# Altium project trinity-board.PrjPcb
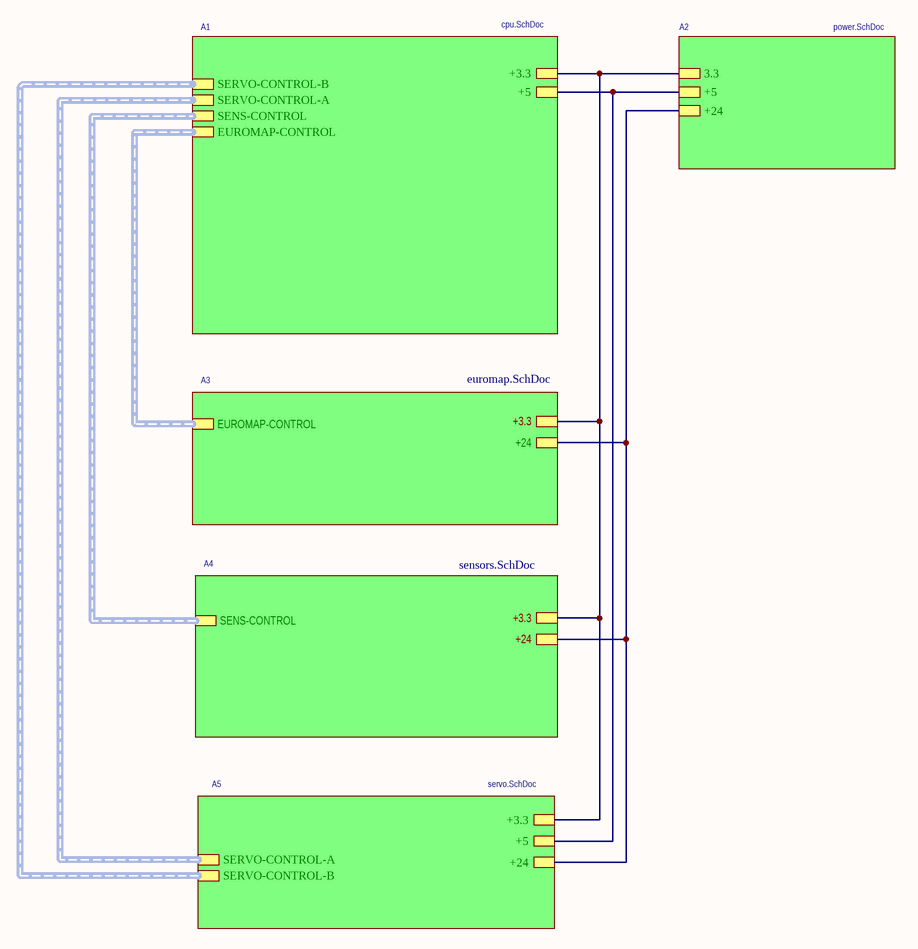
[diagram p0: main-board.SchDoc]
6 sheets, 300 parts. Net scope: hierarchical (ports join the sheet entries above them; power ports are global).
Board file: trinity-m.PcbDoc
Sheets:
  main-board.SchDoc
    A1 = cpu.SchDoc
    A2 = power.SchDoc
    A5 = servo.SchDoc
    A4 = sensors.SchDoc
    A3 = euromap.SchDoc

## Sheet main-board.SchDoc
size A3

### Sub-sheets
A1 = cpu.SchDoc: +3.3, +5, SERVO-CONTROL-B (harness SERVO-CONTROL-B), SERVO-CONTROL-A (harness SERVO-CONTROL-A), SENS-CONTROL (harness SENS-CONTROL), EUROMAP-CONTROL (harness EUROMAP-CONTROL)
A2 = power.SchDoc: +5, +24, 3.3
A3 = euromap.SchDoc: +3.3, EUROMAP-CONTROL (harness EUROMAP-CONTROL), +24
A4 = sensors.SchDoc: SENS-CONTROL (harness SENS-CONTROL), +24, +3.3
A5 = servo.SchDoc: +5, +24, +3.3, SERVO-CONTROL-A (harness SERVO-CONTROL-A), SERVO-CONTROL-B (harness SERVO-CONTROL-B)

### Nets
+3.3: sheet A1/+3.3, sheet A2/3.3, sheet A5/+3.3, sheet A4/+3.3, sheet A3/+3.3
+24: sheet A2/+24, sheet A5/+24, sheet A4/+24, sheet A3/+24
CPU18: sheet A1/+5, sheet A2/+5, sheet A5/+5

### Buses and harness runs
harness sheet A1/EUROMAP-CONTROL = sheet A3/EUROMAP-CONTROL
harness sheet A1/SENS-CONTROL = sheet A4/SENS-CONTROL
harness sheet A1/SERVO-CONTROL-A = sheet A5/SERVO-CONTROL-A
harness sheet A1/SERVO-CONTROL-B = sheet A5/SERVO-CONTROL-B

## Sheet cpu.SchDoc: CENTRAL PROCESSING UNIT
size A3; DocumentNumber: UNCNC.04.00.001
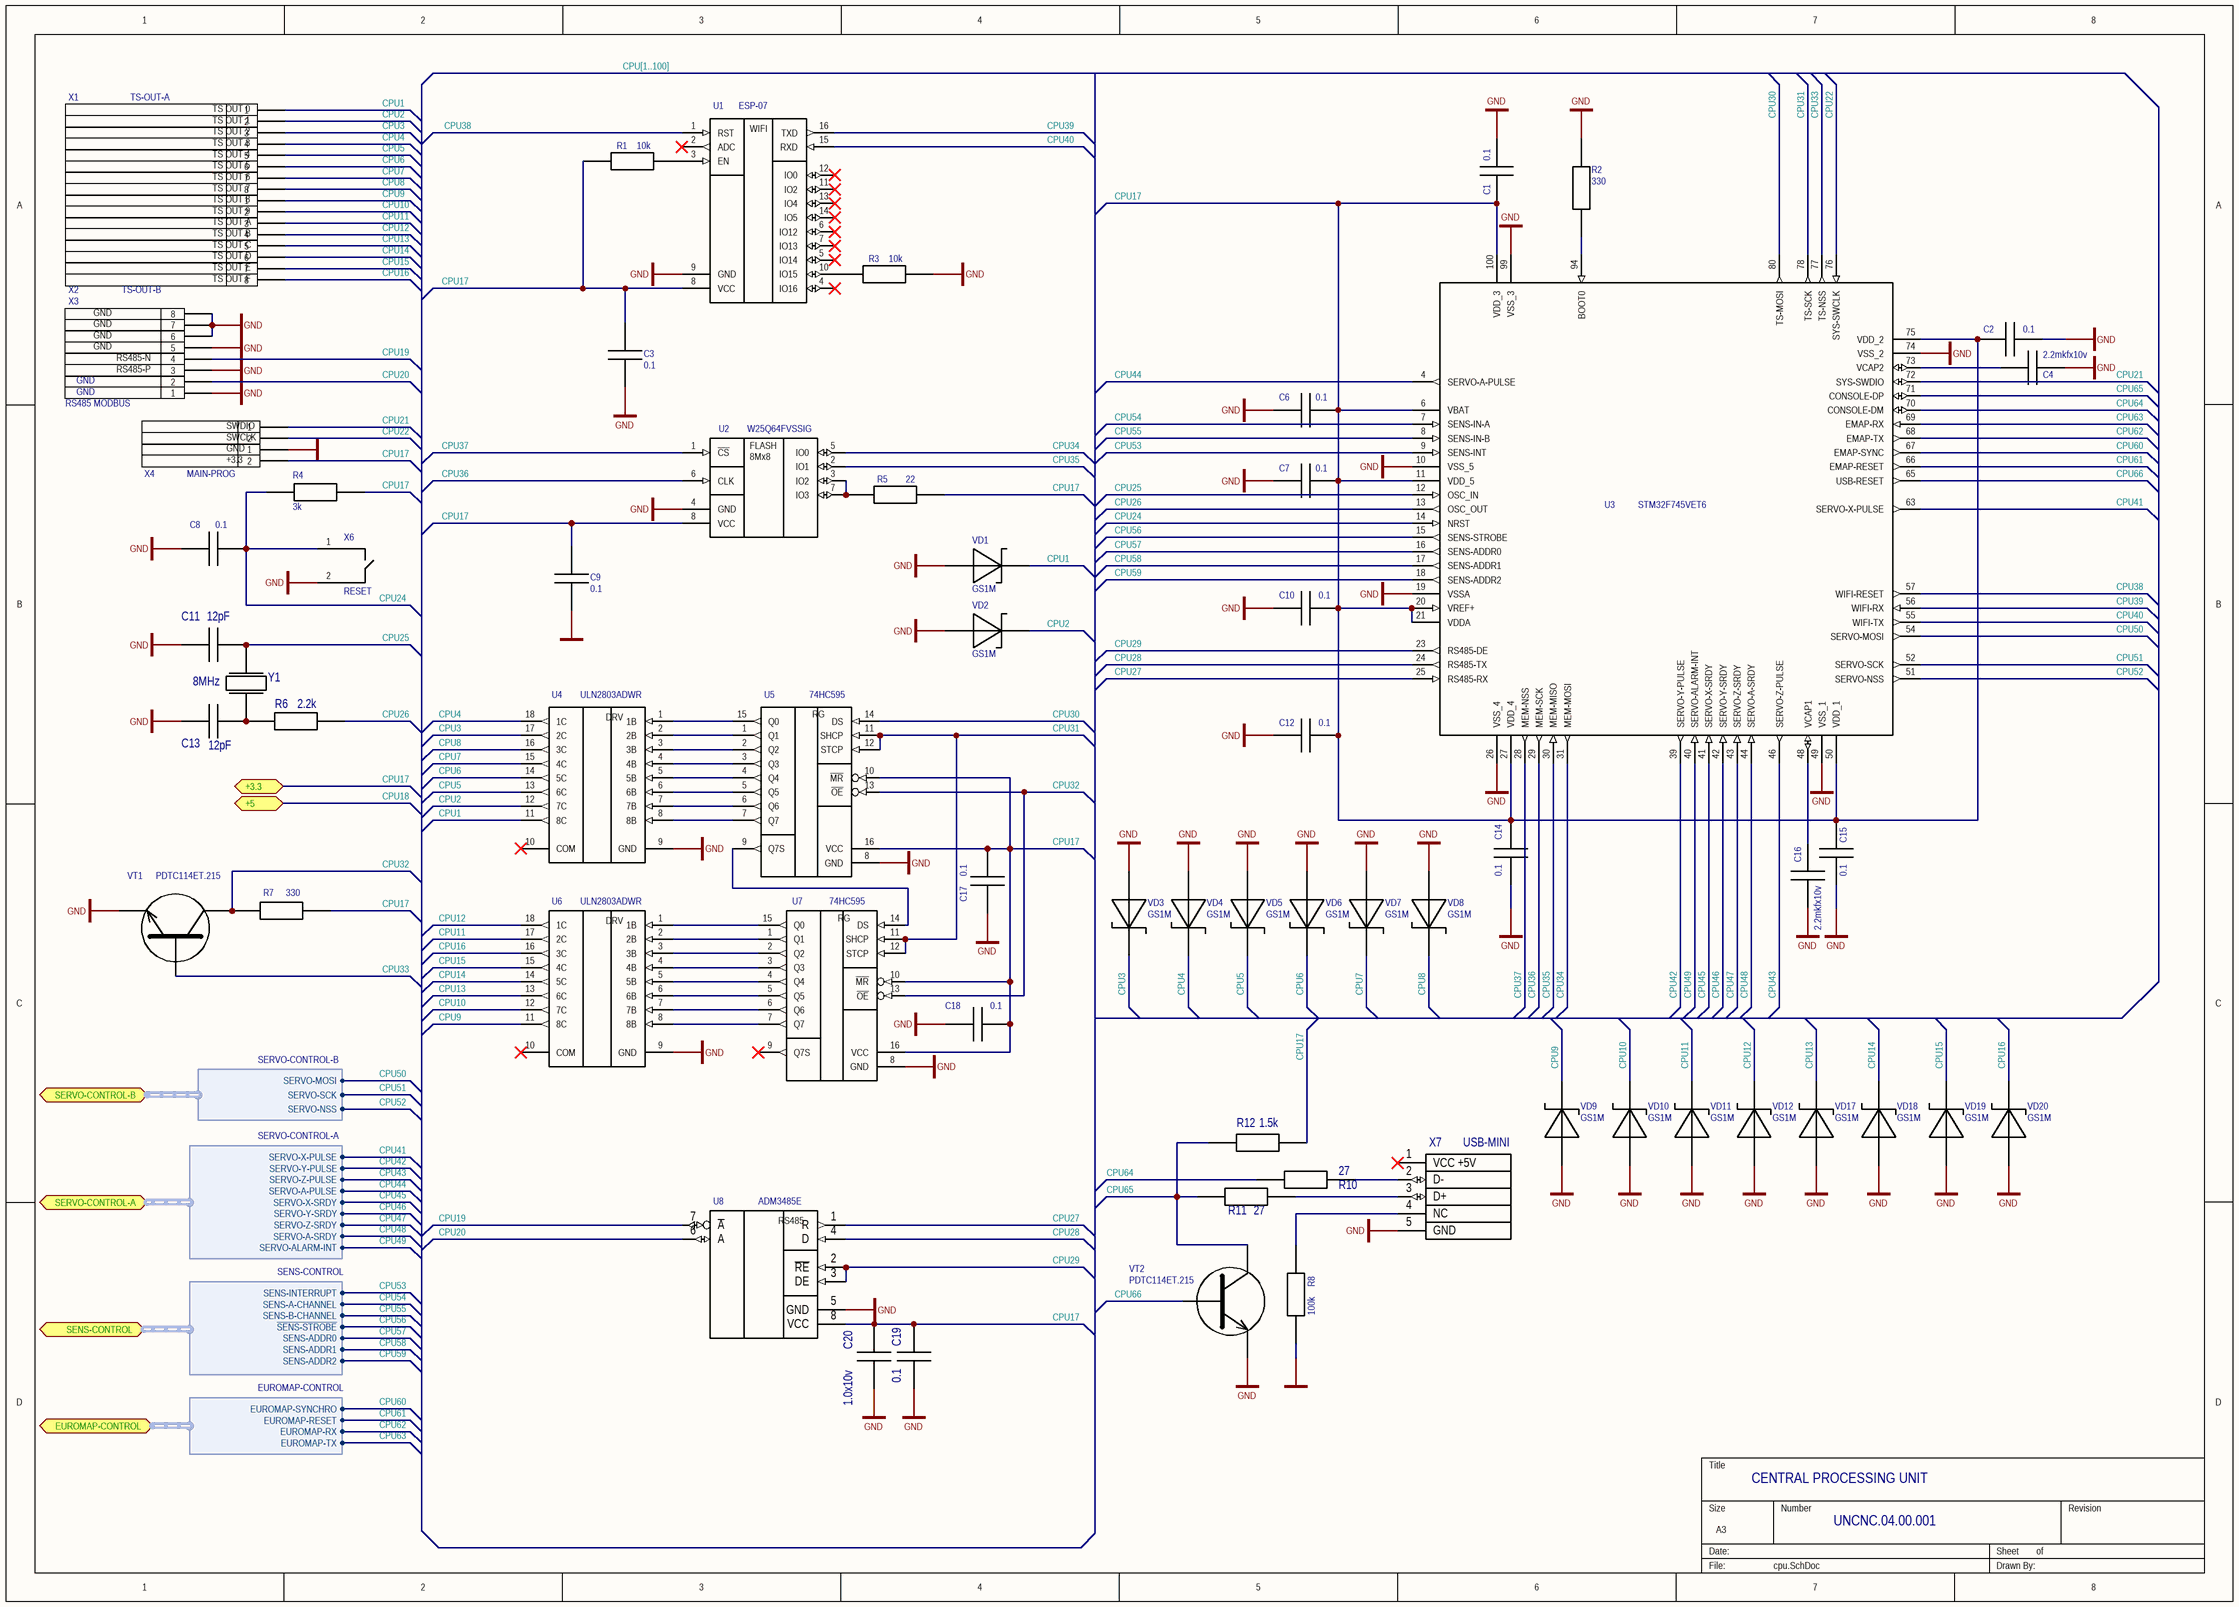
[diagram p1: cpu.SchDoc]

### Parts
C1  0.1  [CAPC1608X05N]
C2  0.1  [CAPC1608X05N]
C3  0.1  [CAPC2012X04N]
C4  2.2mkfx10v  [CAPC1608X05N]
C6  0.1  [CAPC1608X05N]
C7  0.1  [CAPC1608X05N]
C8  0.1  [CAPC1608X05N]
C9  0.1  [CAPC2012X04N]
C10  0.1  [CAPC1608X05N]
C11  12pF  [CAPC1608X05N]
C12  0.1  [CAPC1608X05N]
C13  12pF  [CAPC1608X05N]
C14  0.1  [CAPC1608X05N]
C15  0.1  [CAPC1608X05N]
C16  2.2mkfx10v  [CAPC1608X05N]
C17  0.1  [CAPC2012X04N]
C18  0.1  [CAPC2012X04N]
C19  0.1  [CAPC2012X04N]
C20  1.0x10v  [CAPC2012X04N]
R1  10k  [RESC2012X04N]
R2  330  [RESC1608X05N]
R3  10k  [RESC2012X04N]
R4  3k  [RESC1608X05N]
R5  22  [RESC2012X04N]
R6  2.2k  [RESC1608X05N]
R7  330  [RESC1608X05N]
R8  100k  [RESC2012X04N]
R10  27  [RESC2012X04N]
R11  27  [RESC2012X04N]
R12  1.5k  [RESC2012X04N]
U1  ESP-07  [ESP-07]
U2  W25Q64FVSSIG  [SOIC127P790X203-8N(WIDE)]
U3  STM32F745VET6  [TSQFP50P1600X1600X160-100N]
U4  ULN2803ADWR  [SOIC127P1030X265-18N]
U5  74HC595  [SOP127P700X210-16N]
U6  ULN2803ADWR  [SOIC127P1030X265-18N]
U7  74HC595  [SOP127P700X210-16N]
U8  ADM3485E  [SOIC127P600X175-8N]
VD1  GS1M  [DIOM4336X21N]
VD2  GS1M  [DIOM4336X21N]
VD3  GS1M  [DIOM4336X21N]
VD4  GS1M  [DIOM4336X21N]
VD5  GS1M  [DIOM4336X21N]
VD6  GS1M  [DIOM4336X21N]
VD7  GS1M  [DIOM4336X21N]
VD8  GS1M  [DIOM4336X21N]
VD9  GS1M  [DIOM4336X21N]
VD10  GS1M  [DIOM4336X21N]
VD11  GS1M  [DIOM4336X21N]
VD12  GS1M  [DIOM4336X21N]
VD17  GS1M  [DIOM4336X21N]
VD18  GS1M  [DIOM4336X21N]
VD19  GS1M  [DIOM4336X21N]
VD20  GS1M  [DIOM4336X21N]
VT1  PDTC114ET.215  [SOT95P238X102-3N]
VT2  PDTC114ET.215  [SOT95P238X102-3N]
X1  TS-OUT-A  [MINI-FIT-8-WAY-SM]
X2  TS-OUT-B  [MINI-FIT-8-WAY-SM]
X3  RS485 MODBUS  [RJ45-CAN]
X4  MAIN-PROG  [ZL201-2]
X5  Jamper ZL201  [ZL201-2]  (value not drawn)
X6  RESET  [TACT SWITCH]
X7  USB-MINI  [229-5FB-MINI-USB]
Y1  8MHz  [KX-13]

### Ports
+3.3, +5, EUROMAP-CONTROL (harness EUROMAP-CONTROL), SENS-CONTROL (harness SENS-CONTROL), SERVO-CONTROL-A (harness SERVO-CONTROL-A), SERVO-CONTROL-B (harness SERVO-CONTROL-B)

### Harnesses
SERVO-CONTROL-B: SERVO-MOSI, SERVO-SCK, SERVO-NSS
SERVO-CONTROL-A: SERVO-X-PULSE, SERVO-Y-PULSE, SERVO-Z-PULSE, SERVO-A-PULSE, SERVO-X-SRDY, SERVO-Y-SRDY, SERVO-Z-SRDY, SERVO-A-SRDY, SERVO-ALARM-INT
SENS-CONTROL: SENS-INTERRUPT, SENS-A-CHANNEL, SENS-B-CHANNEL, ~{SENS-STROBE}, SENS-ADDR0, SENS-ADDR1, SENS-ADDR2
EUROMAP-CONTROL: EUROMAP-SYNCHRO, EUROMAP-RESET, EUROMAP-RX, EUROMAP-TX

### Nets
GND: C1.2 C2.1 C3.1 C4.1 C6.2 C7.2 C8.2 C9.1 C10.2 C11.1 C12.2 C13.1 C14.1 C15.1 C16.1 C17.1 C18.1 C19.1 C20.1 R2.2 R3.2 R8.1 U1.9(GND) U2.4(GND) U3.10(VSS_5) U3.19(VSSA) U3.26(VSS_4) U3.49(VSS_1) U3.74(VSS_2) U3.99(VSS_3) U4.9(GND) U5.8(GND) U6.9(GND) U7.8(GND) U8.5(GND) VD1.2(A) VD2.2(A) VD3.2(A) VD4.2(A) VD5.2(A) VD6.2(A) VD7.2(A) VD8.2(A) VD9.2(A) VD10.2(A) VD11.2(A) VD12.2(A) VD17.2(A) VD18.2(A) VD19.2(A) VD20.2(A) VT1.2(E) VT2.2(E) X3.1 X3.3 X3.5 X3.6 X3.7 X3.8 X5.1 X6.2 X7.5(GND)
CPU1: U4.11(8C) VD1.1(C) X1.1
CPU2: U4.12(7C) VD2.1(C) X1.2
CPU3: U4.17(2C) VD3.1(C) X1.3
CPU4: U4.18(1C) VD4.1(C) X1.4
CPU5: U4.13(6C) VD5.1(C) X1.5
CPU6: U4.14(5C) VD6.1(C) X1.6
CPU7: U4.15(4C) VD7.1(C) X1.7
CPU8: U4.16(3C) VD8.1(C) X1.8
CPU9: U6.11(8C) VD9.1(C) X2.1
CPU10: U6.12(7C) VD10.1(C) X2.2
CPU11: U6.17(2C) VD11.1(C) X2.3
CPU12: U6.18(1C) VD12.1(C) X2.4
CPU13: U6.13(6C) VD17.1(C) X2.5
CPU14: U6.14(5C) VD18.1(C) X2.6
CPU15: U6.15(4C) VD19.1(C) X2.7
CPU16: U6.16(3C) VD20.1(C) X2.8
CPU17: C1.1 C2.2 C3.2 C6.1 C7.1 C9.2 C10.1 C12.1 C14.2 C15.2 C17.2 C18.2 C19.2 C20.2 R1.1 R4.1 R5.2 R7.1 R12.2 U1.8(VCC) U2.8(VCC) U3.6(VBAT) U3.11(VDD_5) U3.20(VREF+) U3.21(VDDA) U3.27(VDD_4) U3.50(VDD_1) U3.75(VDD_2) U3.100(VDD_3) U5.10(~{MR}) U5.16(VCC) U7.10(~{MR}) U7.16(VCC) U8.8(VCC) X5.2 ; port +3.3  [project net +3.3]
CPU19: U8.7(~{A}) X3.4
CPU20: U8.6(A) X3.2
CPU21: U3.72(SYS-SWDIO) X4.1
CPU22: U3.76(SYS-SWCLK) X4.2
CPU24: C8.1 R4.2 U3.14(NRST) X6.1
CPU25: C11.2 U3.12(OSC_IN) Y1.2
CPU26: R6.2 U3.13(OSC_OUT)
CPU27: U3.25(RS485-RX) U8.1(R)
CPU28: U3.24(RS485-TX) U8.4(D)
CPU29: U3.23(RS485-DE) U8.2(~{RE}) U8.3(DE)
CPU30: U3.80(TS-MOSI) U5.14(DS)
CPU31: U3.78(TS-SCK) U5.11(SHCP) U5.12(STCP) U7.11(SHCP) U7.12(STCP)
CPU32: R7.2 U5.13(~{OE}) U7.13(~{OE}) VT1.3(C)
CPU33: U3.77(TS-NSS) VT1.1(B)
CPU34: U2.5(IO0) U3.31(MEM-MOSI)
CPU35: U2.2(IO1) U3.30(MEM-MISO)
CPU36: U2.6(CLK) U3.29(MEM-SCK)
CPU37: U2.1(~{CS}) U3.28(MEM-NSS)
CPU38: U1.1(RST) U3.57(WIFI-RESET)
CPU39: U1.16(TXD) U3.56(WIFI-RX)
CPU40: U1.15(RXD) U3.55(WIFI-TX)
CPU41: U3.63(SERVO-X-PULSE) ; port SERVO-CONTROL-A.SERVO-X-PULSE
CPU42: U3.39(SERVO-Y-PULSE) ; port SERVO-CONTROL-A.SERVO-Y-PULSE
CPU43: U3.46(SERVO-Z-PULSE) ; port SERVO-CONTROL-A.SERVO-Z-PULSE
CPU44: U3.4(SERVO-A-PULSE) ; port SERVO-CONTROL-A.SERVO-A-PULSE
CPU45: U3.41(SERVO-X-SRDY) ; port SERVO-CONTROL-A.SERVO-X-SRDY
CPU46: U3.42(SERVO-Y-SRDY) ; port SERVO-CONTROL-A.SERVO-Y-SRDY
CPU47: U3.43(SERVO-Z-SRDY) ; port SERVO-CONTROL-A.SERVO-Z-SRDY
CPU48: U3.44(SERVO-A-SRDY) ; port SERVO-CONTROL-A.SERVO-A-SRDY
CPU49: U3.40(SERVO-ALARM-INT) ; port SERVO-CONTROL-A.SERVO-ALARM-INT
CPU50: U3.54(SERVO-MOSI) ; port SERVO-CONTROL-B.SERVO-MOSI
CPU51: U3.52(SERVO-SCK) ; port SERVO-CONTROL-B.SERVO-SCK
CPU52: U3.51(SERVO-NSS) ; port SERVO-CONTROL-B.SERVO-NSS
CPU53: U3.9(SENS-INT) ; port SENS-CONTROL.SENS-INTERRUPT
CPU54: U3.7(SENS-IN-A) ; port SENS-CONTROL.SENS-A-CHANNEL
CPU55: U3.8(SENS-IN-B) ; port SENS-CONTROL.SENS-B-CHANNEL
CPU56: U3.15(SENS-STROBE) ; port SENS-CONTROL.~{SENS-STROBE}
CPU57: U3.16(SENS-ADDR0) ; port SENS-CONTROL.SENS-ADDR0
CPU58: U3.17(SENS-ADDR1) ; port SENS-CONTROL.SENS-ADDR1
CPU59: U3.18(SENS-ADDR2) ; port SENS-CONTROL.SENS-ADDR2
CPU60: U3.67(EMAP-SYNC) ; port EUROMAP-CONTROL.EUROMAP-SYNCHRO
CPU61: U3.66(EMAP-RESET) ; port EUROMAP-CONTROL.EUROMAP-RESET
CPU62: U3.68(EMAP-TX) ; port EUROMAP-CONTROL.EUROMAP-RX
CPU63: U3.69(EMAP-RX) ; port EUROMAP-CONTROL.EUROMAP-TX
CPU64: R10.1 U3.70(CONSOLE-DM)
CPU65: R11.1 R12.1 U3.71(CONSOLE-DP) VT2.3(C)
CPU66: U3.65(USB-RESET) VT2.1(B)
NetC4_2: C4.2 U3.73(VCAP2)
NetC13_2: C13.2 R6.1 Y1.1
NetC16_2: C16.2 U3.48(VCAP1)
NetR1_2: R1.2 U1.3(EN)
NetR2_1: R2.1 U3.94(BOOT0)
NetR3_1: R3.1 U1.10(IO15)
NetR5_1: R5.1 U2.3(IO2) U2.7(IO3)
NetR8_2: R8.2 X7.4(NC)
NetR10_2: R10.2 X7.2(D-)
NetR11_2: R11.2 X7.3(D+)
NetU4_1: U4.1(1B) U5.15(Q0)
NetU4_2: U4.2(2B) U5.1(Q1)
NetU4_3: U4.3(3B) U5.2(Q2)
NetU4_4: U4.4(4B) U5.3(Q3)
NetU4_5: U4.5(5B) U5.4(Q4)
NetU4_6: U4.6(6B) U5.5(Q5)
NetU4_7: U4.7(7B) U5.6(Q6)
NetU4_8: U4.8(8B) U5.7(Q7)
NetU5_9: U5.9(Q7S) U7.14(DS)
NetU6_1: U6.1(1B) U7.15(Q0)
NetU6_2: U6.2(2B) U7.1(Q1)
NetU6_3: U6.3(3B) U7.2(Q2)
NetU6_4: U6.4(4B) U7.3(Q3)
NetU6_5: U6.5(5B) U7.4(Q4)
NetU6_6: U6.6(6B) U7.5(Q5)
NetU6_7: U6.7(7B) U7.6(Q6)
NetU6_8: U6.8(8B) U7.7(Q7)

Not connected (* = marked no-connect by the designer): U1 2(ADC)* 4(IO16)* 5(IO14)* 6(IO12)* 7(IO13)* 11(IO2)* 12(IO0)* 13(IO4)* 14(IO5)*; U3 1(PE2) 2(PE3) 3(PE4) 5(PE6) 22(PA0-WKUP) 32(PC4) 33(PC5) 34(PB0) 35(PB1) 36(PB2) 37(PE7) 38(PE8) 45(PE15) 47(PB11) 53(PB14) 58(PD11) 59(PD12) 60(PD13) 61(PD14) 62(PD15) 64(PC7) 79(PC11) 81(PD0) 82(PD1) 83(PD2) 84(PD3) 85(PD4) 86(PD5) 87(PD6) 88(PD7) 89(PB3) 90(PB4) 91(PB5) 92(PB6) 93(PB7) 95(PB8) 96(PB9) 97(PE0) 98(PE1); U4 10(COM)*; U6 10(COM)*; U7 9(Q7S)*; X7 1(VCC_+5V)*

### Buses and harness runs
bus CPU[1..100]

### Notes on the sheet
- (near X1) TS OUT 0
- (near X1) TS OUT 1
- (near X1) TS OUT 2
- TS OUT 3
- TS OUT 4
- TS OUT 5
- TS OUT 6
- TS OUT 7
- TS OUT 8
- TS OUT 9
- TS OUT A
- TS OUT B
- TS OUT C
- TS OUT D
- GND
- TS OUT E
- TS OUT F
- RS485-N
- RS485-P
- SWDIO
- SWCLK
- +3.3
- (in symbol 74HC595) RG
- (in symbol ESP-07 Wi-Fi module) WIFI
- (in symbol SN65176BD) RS485
- (in symbol ULN2803ADWR) DRV
- (in symbol W25Q64FVSSIG) FLASH; 8Mx8

### Library data of the parts
C1-C4 C6-C20 = C: SMD конденсатор; Ref: http://www.kosmodrom.com.ua/prodlist.php?name=cap1206
R1-R8 R10-R12 = R: SMD резистор; Ref: http://www.kosmodrom.com.ua/prodlist.php?name=res1206
U1 = ESP-07 Wi-Fi module: WIFI модуль; Ref: http://www.kosmodrom.com.ua/el.php?name=ESP8266-ESP-07
U2 = W25Q64FVSSIG: FLASH 8Mx8
U3 = STM32F745VET6: ARM7 microcontroller
U4 U6 = ULN2803ADWR: 8 Darlington transistors
U8 = SN65176BD: RS-485 line driver; Ref: http://www.kosmodrom.com.ua/prodlist.php?page=0&name=SN65176BD&okbutton=%CF%EE%E8%F1%EA+%EF%EE+%F1%EA%EB%E0%E4%F3
VD1-VD12 VD17-VD20 = SS26: диод Шоттки
VT1 VT2 = PDTC114ET.215: NPN transistor with bias circuit
X1 X2 = MINI-FIT-8-WAY-M
X3 = RJ45-CAN: CAN-Bus connector; Ref: http://www.kosmodrom.com.ua/el.php?name=TJ9S-8P8C
X4 = Jamper ZL201
X6 = TACT SWITCH
X7 = USB-MINI: Разъем USB-B розетка; Ref: http://www.kosmodrom.com.ua/el.php?name=229-5FB
Y1 = CERAMIC-RESONATOR: Кварцевый резонатор; Ref( 8MHz): http://www.kosmodrom.com.ua/el.php?name=KX-13-8.0-MHz; Ref (6MHz): http://www.kosmodrom.com.ua/el.php?name=KX-13%206.0%20MHz

## Sheet power.SchDoc
size A3
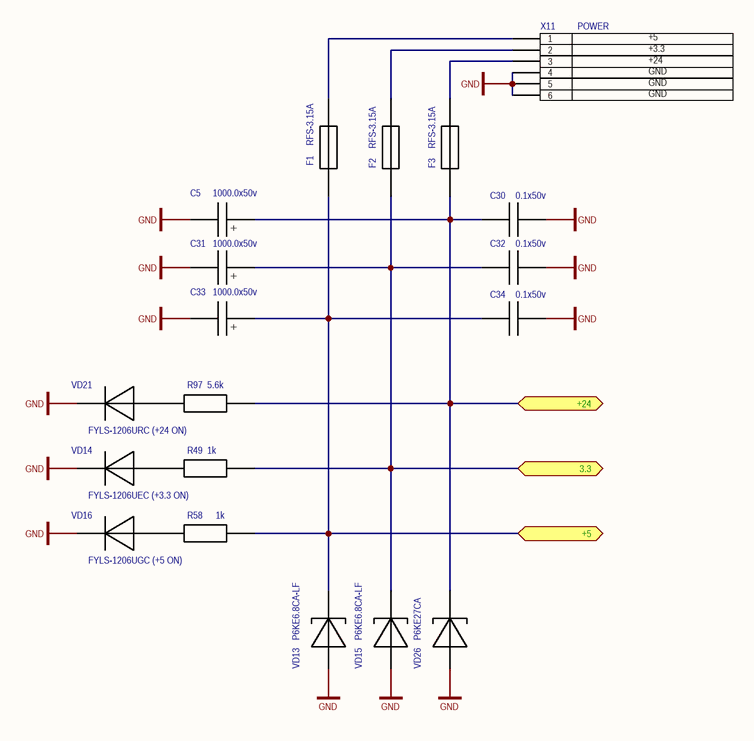
[diagram p2: power.SchDoc]

### Parts
C5  1000.0x50v  [C-LOW-ESR-16-18]
C30  0.1x50v  [CAPC3216X05N]
C31  1000.0x50v  [C-LOW-ESR-16-18]
C32  0.1x50v  [CAPC3216X05N]
C33  1000.0x50v  [C-LOW-ESR-16-18]
C34  0.1x50v  [CAPC3216X05N]
F1  RFS-3.15A  [MRT-FUSE]
F2  RFS-3.15A  [MRT-FUSE]
F3  RFS-3.15A  [MRT-FUSE]
R49  1k  [RESC2012X04N]
R58  1k  [RESC2012X04N]
R97  5.6k  [RESC2012X04N]
VD13  P6KE6.8CA-LF  [P6KE27CA]
VD14  FYLS-1206UEC (+3.3 ON)  [CAPMP3216X11N]
VD15  P6KE6.8CA-LF  [P6KE27CA]
VD16  FYLS-1206UGC (+5 ON)  [CAPMP3216X11N]
VD21  FYLS-1206URC (+24 ON)  [CAPMP3216X11N]
VD26  P6KE27CA  [P6KE27CA]
X11  POWER  [MINI-FIT-6WAY-SM]

### Ports
3.3, +5, +24

### Nets
GND: C5.2 C30.2 C31.2 C32.2 C33.2 C34.2 VD13.A VD14.1(C) VD15.A VD16.1(C) VD21.1(C) VD26.A X11.4 X11.5 X11.6
+3.3: C31.1(+) C32.1 F2.1 R49.2 VD15.K ; port 3.3
+24: C5.1(+) C30.1 F3.1 R97.2 VD26.K ; port +24
CPU18: C33.1(+) C34.1 F1.1 R58.2 VD13.K ; port +5
NetF1_2: F1.2 X11.1
NetF2_2: F2.2 X11.2
NetF3_2: F3.2 X11.3
NetR49_1: R49.1 VD14.2(A)
NetR58_1: R58.1 VD16.2(A)
NetR97_1: R97.1 VD21.2(A)

### Notes on the sheet
- +5
- +3.3
- +24
- GND

### Library data of the parts
C5 C31 C33 = C-LOW-ESR-RADIAL: Выводной электролит
C30 C32 C34 = C: SMD конденсатор; Ref: http://www.kosmodrom.com.ua/prodlist.php?name=cap1206
F1-F3 = FUSE: Вставка плавкая; Ref: http://www.kosmodrom.com.ua/el.php?name=RFT-2.5A
R49 R58 R97 = R: SMD резистор; Ref: http://www.kosmodrom.com.ua/prodlist.php?name=res1206
VD13 VD15 VD26 = P6KE27CA: Cупрессор; Ref: https://prom.ua/p207053054-p6ke27ca;all.html
VD14 VD16 VD21 = FYLS-1206: Светодиод; Ref: http://www.kosmodrom.com.ua/prodlist.php?page=0&name=FYLS-1206&okbutton=%CF%EE%E8%F1%EA+%EF%EE+%F1%EA%EB%E0%E4%F3
X11 = MINI-FIT-6-WAY-M

## Sheet servo.SchDoc: SERVOCONTROLLER module
size A3; DocumentNumber: UCNC.03.00.001
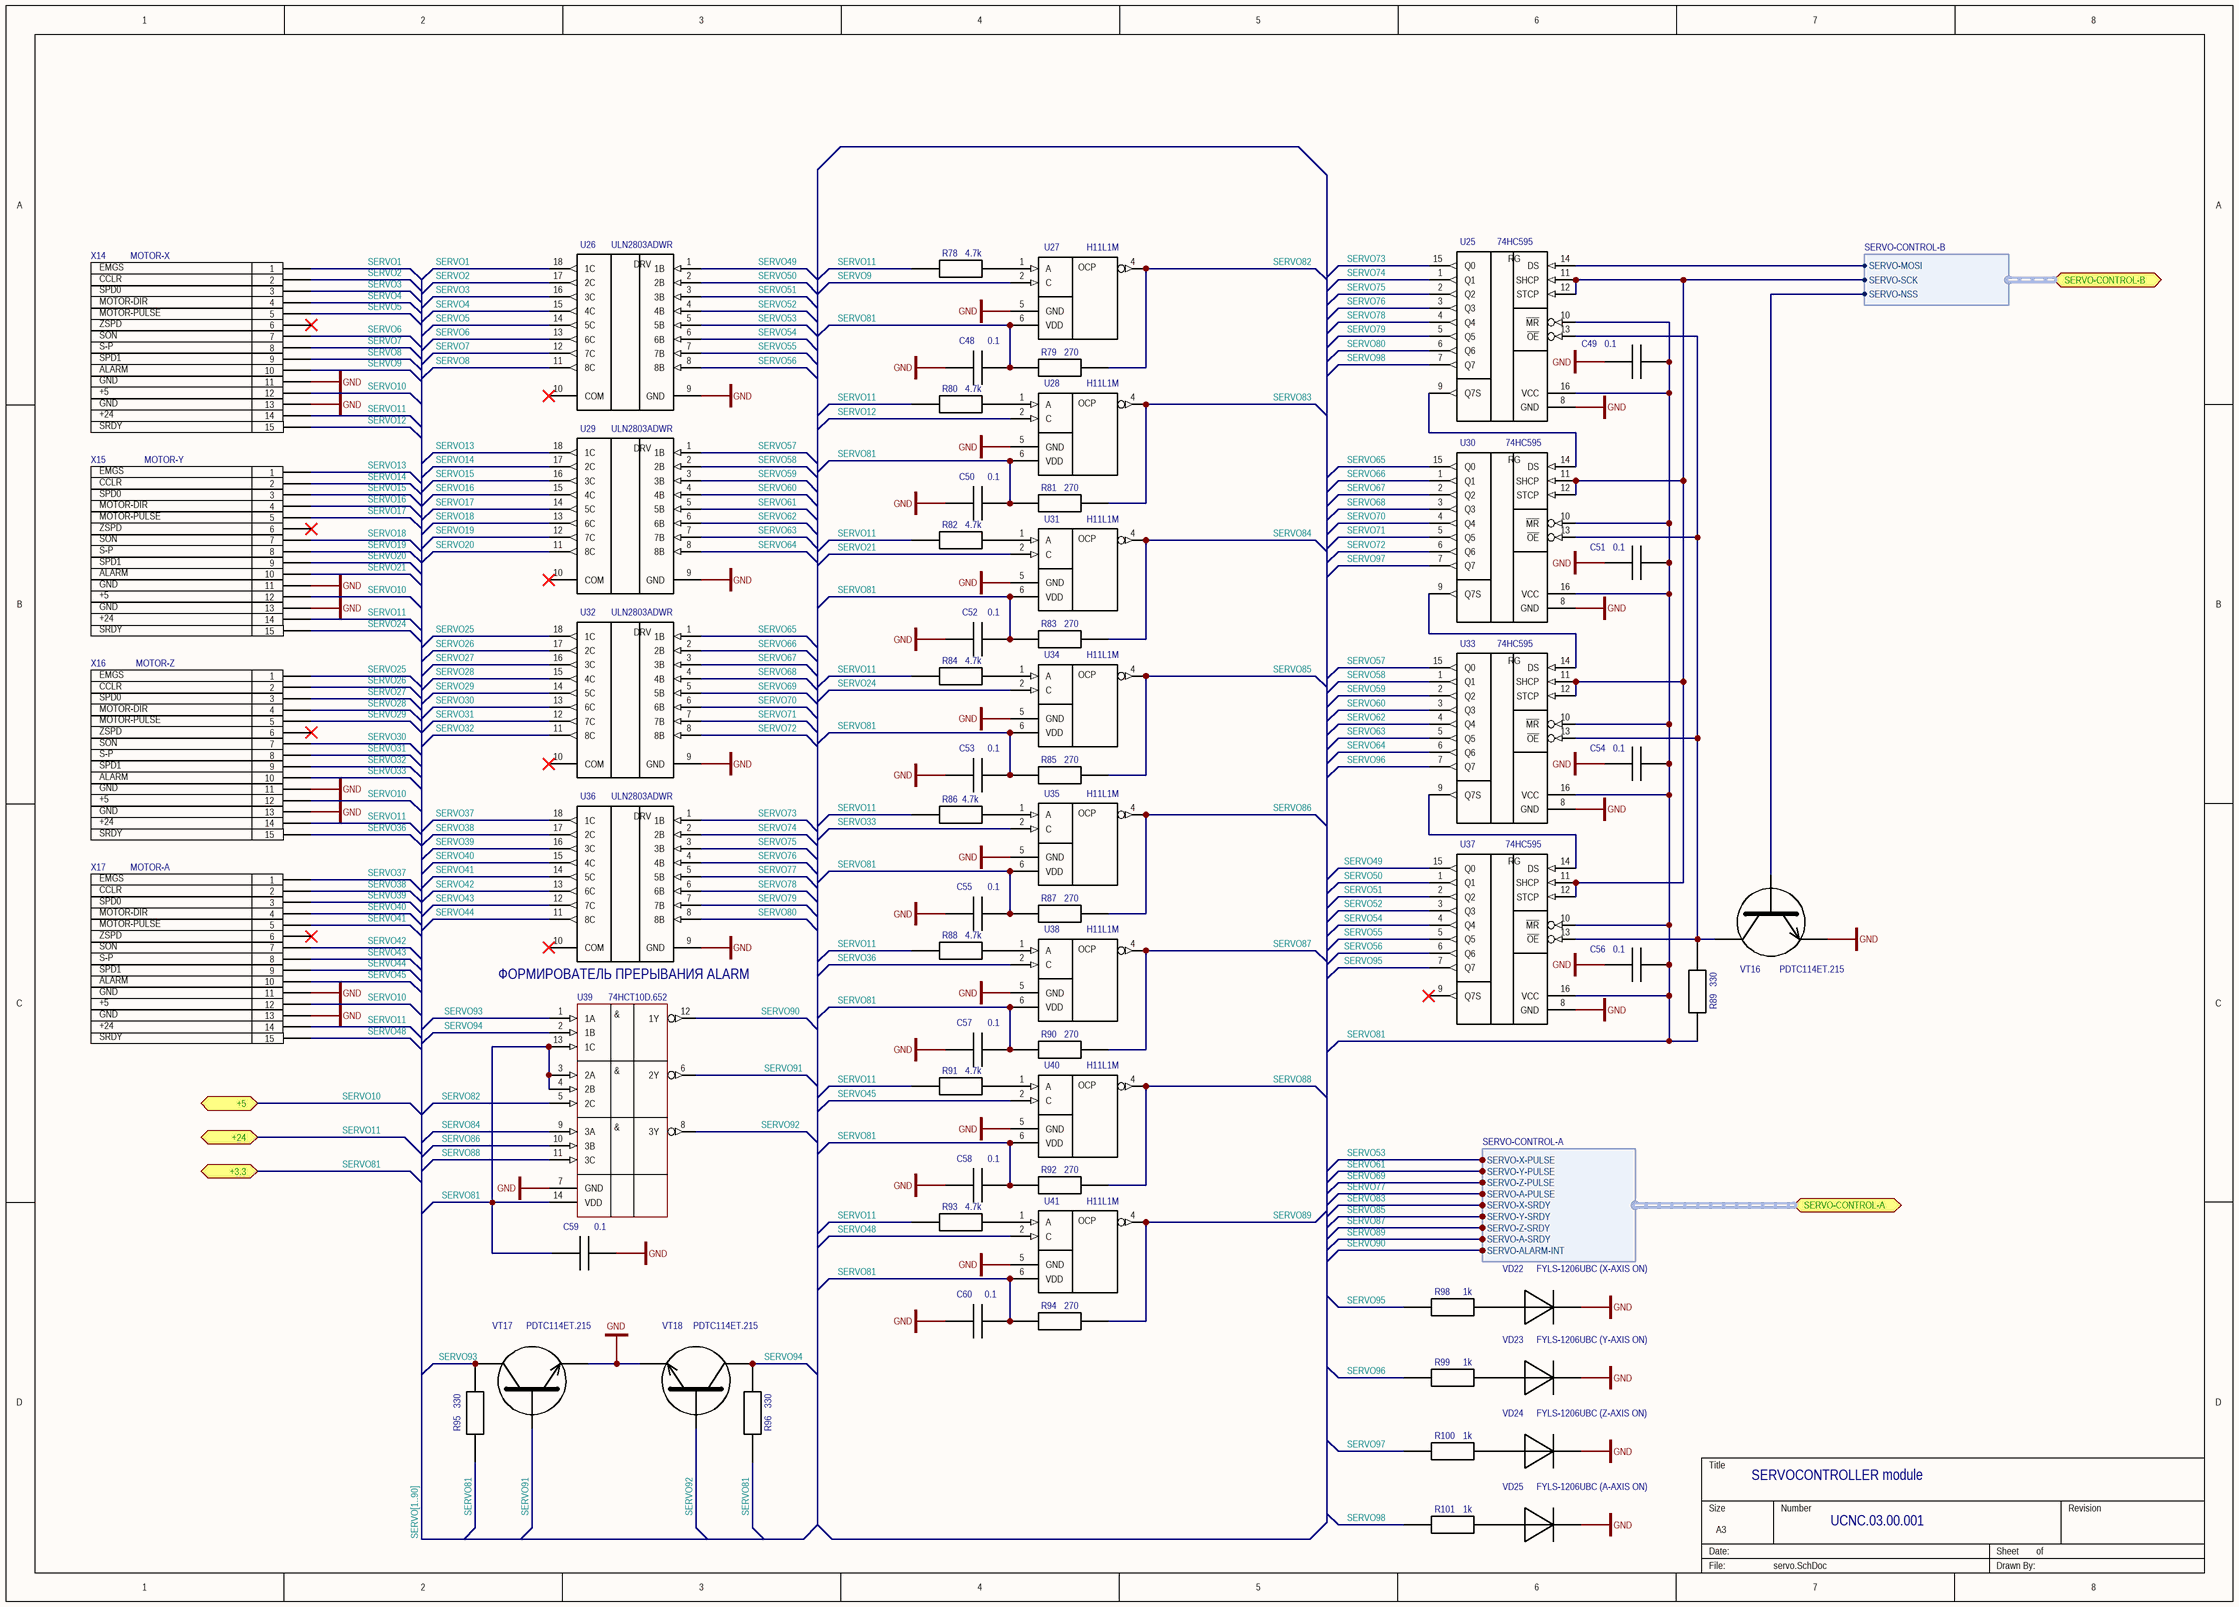
[diagram p3: servo.SchDoc]

### Parts
C48  0.1  [CAPC2012X04N]
C49  0.1  [CAPC2012X04N]
C50  0.1  [CAPC2012X04N]
C51  0.1  [CAPC2012X04N]
C52  0.1  [CAPC2012X04N]
C53  0.1  [CAPC2012X04N]
C54  0.1  [CAPC2012X04N]
C55  0.1  [CAPC2012X04N]
C56  0.1  [CAPC2012X04N]
C57  0.1  [CAPC2012X04N]
C58  0.1  [CAPC2012X04N]
C59  0.1  [CAPC2012X04N]
C60  0.1  [CAPC2012X04N]
R78  4.7k  [RESC2012X04N]
R79  270  [RESC2012X04N]
R80  4.7k  [RESC2012X04N]
R81  270  [RESC2012X04N]
R82  4.7k  [RESC2012X04N]
R83  270  [RESC2012X04N]
R84  4.7k  [RESC2012X04N]
R85  270  [RESC2012X04N]
R86  4.7k  [RESC2012X04N]
R87  270  [RESC2012X04N]
R88  4.7k  [RESC2012X04N]
R89  330  [RESC1608X05N]
R90  270  [RESC2012X04N]
R91  4.7k  [RESC2012X04N]
R92  270  [RESC2012X04N]
R93  4.7k  [RESC2012X04N]
R94  270  [RESC2012X04N]
R95  330  [RESC2012X04N]
R96  330  [RESC2012X04N]
R98  1k  [RESC2012X04N]
R99  1k  [RESC2012X04N]
R100  1k  [RESC2012X04N]
R101  1k  [RESC2012X04N]
U25  74HC595  [SOP127P700X210-16N]
U26  ULN2803ADWR  [SOIC127P1030X265-18N]
U27  H11L1M  [DIP6]
U28  H11L1M  [DIP6]
U29  ULN2803ADWR  [SOIC127P1030X265-18N]
U30  74HC595  [SOP127P700X210-16N]
U31  H11L1M  [DIP6]
U32  ULN2803ADWR  [SOIC127P1030X265-18N]
U33  74HC595  [SOP127P700X210-16N]
U34  H11L1M  [DIP6]
U35  H11L1M  [DIP6]
U36  ULN2803ADWR  [SOIC127P1030X265-18N]
U37  74HC595  [SOP127P700X210-16N]
U38  H11L1M  [DIP6]
U39  74HCT10D.652  [SOIC127P600X175-14N]
U40  H11L1M  [DIP6]
U41  H11L1M  [DIP6]
VD22  FYLS-1206UBC (X-AXIS ON)  [CAPMP3216X11N]
VD23  FYLS-1206UBC (Y-AXIS ON)  [CAPMP3216X11N]
VD24  FYLS-1206UBC (Z-AXIS ON)  [CAPMP3216X11N]
VD25  FYLS-1206UBC (A-AXIS ON)  [CAPMP3216X11N]
VT16  PDTC114ET.215  [SOT95P238X102-3N]
VT17  PDTC114ET.215  [SOT95P238X102-3N]
VT18  PDTC114ET.215  [SOT95P238X102-3N]
X14  MOTOR-X  [DMR15F-HD]
X15  MOTOR-Y  [DMR15F-HD]
X16  MOTOR-Z  [DMR15F-HD]
X17  MOTOR-A  [DMR15F-HD]

### Ports
+3.3, +5, +24, SERVO-CONTROL-A (harness SERVO-CONTROL-A), SERVO-CONTROL-B (harness SERVO-CONTROL-B)

### Harnesses
SERVO-CONTROL-A: SERVO-X-PULSE, SERVO-Y-PULSE, SERVO-Z-PULSE, SERVO-A-PULSE, SERVO-X-SRDY, SERVO-Y-SRDY, SERVO-Z-SRDY, SERVO-A-SRDY, SERVO-ALARM-INT
SERVO-CONTROL-B: SERVO-MOSI, SERVO-SCK, SERVO-NSS

### Nets
GND: C48.1 C49.2 C50.1 C51.2 C52.1 C53.1 C54.2 C55.1 C56.2 C57.1 C58.1 C59.2 C60.1 U25.8(GND) U26.9(GND) U27.5(GND) U28.5(GND) U29.9(GND) U30.8(GND) U31.5(GND) U32.9(GND) U33.8(GND) U34.5(GND) U35.5(GND) U36.9(GND) U37.8(GND) U38.5(GND) U39.7(GND) U40.5(GND) U41.5(GND) VD22.1(C) VD23.1(C) VD24.1(C) VD25.1(C) VT16.2(E) VT17.2(E) VT18.2(E) X14.11 X14.13 X15.11 X15.13 X16.11 X16.13 X17.11 X17.13
CPU50: U25.14(DS) ; port SERVO-CONTROL-B.SERVO-MOSI
CPU51: U25.11(SHCP) U25.12(STCP) U30.11(SHCP) U30.12(STCP) U33.11(SHCP) U33.12(STCP) U37.11(SHCP) U37.12(STCP) ; port SERVO-CONTROL-B.SERVO-SCK
CPU52: VT16.1(B) ; port SERVO-CONTROL-B.SERVO-NSS
SERVO1: U26.18(1C) X14.1
SERVO2: U26.17(2C) X14.2
SERVO3: U26.16(3C) X14.3
SERVO4: U26.15(4C) X14.4
SERVO5: U26.14(5C) X14.5
SERVO6: U26.13(6C) X14.7
SERVO7: U26.12(7C) X14.8
SERVO8: U26.11(8C) X14.9
SERVO9: U27.2(C) X14.10
SERVO10: X14.12 X15.12 X16.12 X17.12 ; port +5  [project net CPU18]
SERVO11: R78.1 R80.1 R82.1 R84.1 R86.1 R88.1 R91.1 R93.1 X14.14 X15.14 X16.14 X17.14 ; port +24  [project net +24]
SERVO12: U28.2(C) X14.15
SERVO13: U29.18(1C) X15.1
SERVO14: U29.17(2C) X15.2
SERVO15: U29.16(3C) X15.3
SERVO16: U29.15(4C) X15.4
SERVO17: U29.14(5C) X15.5
SERVO18: U29.13(6C) X15.7
SERVO19: U29.12(7C) X15.8
SERVO20: U29.11(8C) X15.9
SERVO21: U31.2(C) X15.10
SERVO24: U34.2(C) X15.15
SERVO25: U32.18(1C) X16.1
SERVO26: U32.17(2C) X16.2
SERVO27: U32.16(3C) X16.3
SERVO28: U32.15(4C) X16.4
SERVO29: U32.14(5C) X16.5
SERVO30: U32.13(6C) X16.7
SERVO31: U32.12(7C) X16.8
SERVO32: U32.11(8C) X16.9
SERVO33: U35.2(C) X16.10
SERVO36: U38.2(C) X16.15
SERVO37: U36.18(1C) X17.1
SERVO38: U36.17(2C) X17.2
SERVO39: U36.16(3C) X17.3
SERVO40: U36.15(4C) X17.4
SERVO41: U36.14(5C) X17.5
SERVO42: U36.13(6C) X17.7
SERVO43: U36.12(7C) X17.8
SERVO44: U36.11(8C) X17.9
SERVO45: U40.2(C) X17.10
SERVO48: U41.2(C) X17.15
SERVO49: U26.1(1B) U37.15(Q0)
SERVO50: U26.2(2B) U37.1(Q1)
SERVO51: U26.3(3B) U37.2(Q2)
SERVO52: U26.4(4B) U37.3(Q3)
SERVO53: U26.5(5B) ; port SERVO-CONTROL-A.SERVO-X-PULSE  [project net CPU41]
SERVO54: U26.6(6B) U37.4(Q4)
SERVO55: U26.7(7B) U37.5(Q5)
SERVO56: U26.8(8B) U37.6(Q6)
SERVO57: U29.1(1B) U33.15(Q0)
SERVO58: U29.2(2B) U33.1(Q1)
SERVO59: U29.3(3B) U33.2(Q2)
SERVO60: U29.4(4B) U33.3(Q3)
SERVO61: U29.5(5B) ; port SERVO-CONTROL-A.SERVO-Y-PULSE  [project net CPU42]
SERVO62: U29.6(6B) U33.4(Q4)
SERVO63: U29.7(7B) U33.5(Q5)
SERVO64: U29.8(8B) U33.6(Q6)
SERVO65: U30.15(Q0) U32.1(1B)
SERVO66: U30.1(Q1) U32.2(2B)
SERVO67: U30.2(Q2) U32.3(3B)
SERVO68: U30.3(Q3) U32.4(4B)
SERVO69: U32.5(5B) ; port SERVO-CONTROL-A.SERVO-Z-PULSE  [project net CPU43]
SERVO70: U30.4(Q4) U32.6(6B)
SERVO71: U30.5(Q5) U32.7(7B)
SERVO72: U30.6(Q6) U32.8(8B)
SERVO73: U25.15(Q0) U36.1(1B)
SERVO74: U25.1(Q1) U36.2(2B)
SERVO75: U25.2(Q2) U36.3(3B)
SERVO76: U25.3(Q3) U36.4(4B)
SERVO77: U36.5(5B) ; port SERVO-CONTROL-A.SERVO-A-PULSE  [project net CPU44]
SERVO78: U25.4(Q4) U36.6(6B)
SERVO79: U25.5(Q5) U36.7(7B)
SERVO80: U25.6(Q6) U36.8(8B)
SERVO81: C48.2 C49.1 C50.2 C51.1 C52.2 C53.2 C54.1 C55.2 C56.1 C57.2 C58.2 C59.1 C60.2 R79.1 R81.1 R83.1 R85.1 R87.1 R89.1 R90.1 R92.1 R94.1 R95.1 R96.1 U25.10(~{MR}) U25.16(VCC) U27.6(VDD) U28.6(VDD) U30.10(~{MR}) U30.16(VCC) U31.6(VDD) U33.10(~{MR}) U33.16(VCC) U34.6(VDD) U35.6(VDD) U37.10(~{MR}) U37.16(VCC) U38.6(VDD) U39.3(2A) U39.4(2B) U39.13(1C) U39.14(VDD) U40.6(VDD) U41.6(VDD) ; port +3.3  [project net +3.3]
SERVO82: R79.2 U27.4(OUT) U39.5(2C)
SERVO83: R81.2 U28.4(OUT) ; port SERVO-CONTROL-A.SERVO-X-SRDY  [project net CPU45]
SERVO84: R83.2 U31.4(OUT) U39.9(3A)
SERVO85: R85.2 U34.4(OUT) ; port SERVO-CONTROL-A.SERVO-Y-SRDY  [project net CPU46]
SERVO86: R87.2 U35.4(OUT) U39.10(3B)
SERVO87: R90.2 U38.4(OUT) ; port SERVO-CONTROL-A.SERVO-Z-SRDY  [project net CPU47]
SERVO88: R92.2 U39.11(3C) U40.4(OUT)
SERVO89: R94.2 U41.4(OUT) ; port SERVO-CONTROL-A.SERVO-A-SRDY  [project net CPU48]
SERVO90: U39.12(1Y) ; port SERVO-CONTROL-A.SERVO-ALARM-INT  [project net CPU49]
SERVO91: U39.6(2Y) VT17.1(B)
SERVO92: U39.8(3Y) VT18.1(B)
SERVO93: R95.2 U39.1(1A) VT17.3(C)
SERVO94: R96.2 U39.2(1B) VT18.3(C)
SERVO95: R98.2 U37.7(Q7)
SERVO96: R99.2 U33.7(Q7)
SERVO97: R100.2 U30.7(Q7)
SERVO98: R101.2 U25.7(Q7)
NetR78_2: R78.2 U27.1(A)
NetR80_2: R80.2 U28.1(A)
NetR82_2: R82.2 U31.1(A)
NetR84_2: R84.2 U34.1(A)
NetR86_2: R86.2 U35.1(A)
NetR88_2: R88.2 U38.1(A)
NetR89_2: R89.2 U25.13(~{OE}) U30.13(~{OE}) U33.13(~{OE}) U37.13(~{OE}) VT16.3(C)
NetR91_2: R91.2 U40.1(A)
NetR93_2: R93.2 U41.1(A)
NetR98_1: R98.1 VD22.2(A)
NetR99_1: R99.1 VD23.2(A)
NetR100_1: R100.1 VD24.2(A)
NetR101_1: R101.1 VD25.2(A)
NetU25_9: U25.9(Q7S) U30.14(DS)
NetU30_9: U30.9(Q7S) U33.14(DS)
NetU33_9: U33.9(Q7S) U37.14(DS)

Not connected (* = marked no-connect by the designer): U26 10(COM)*; U29 10(COM)*; U32 10(COM)*; U36 10(COM)*; U37 9(Q7S)*; X14 6*; X15 6*; X16 6*; X17 6*

### Buses and harness runs
bus SERVO[1..90]

### Notes on the sheet
- ZSPD
- EMGS
- SPD0
- CCLR
- SON
- MOTOR-DIR
- MOTOR-PULSE
- GND
- +5
- ALARM
- S-P
- SPD1
- +24
- SRDY
- (near U36) ФОРМИРОВАТЕЛЬ ПРЕРЫВАНИЯ ALARM
- (in symbol 74HC595) RG
- (in symbol 74HCT10D.652) &
- (in symbol H11L1M) OCP
- (in symbol ULN2803ADWR) DRV

### Library data of the parts
C48-C60 = C: SMD конденсатор; Ref: http://www.kosmodrom.com.ua/prodlist.php?name=cap1206
R78-R96 R98-R101 = R: SMD резистор; Ref: http://www.kosmodrom.com.ua/prodlist.php?name=res1206
U26 U29 U32 U36 = ULN2803ADWR: 8 Darlington transistors
U27 U28 U31 U34 U35 U38 U40 U41 = H11L1M: Fairchild H11L1M Schmitt Trigger Output Optocoupler; Ref: http://www.kosmodrom.com.ua/el.php?name=H11L1M
VD22-VD25 = FYLS-1206: Светодиод; Ref: http://www.kosmodrom.com.ua/prodlist.php?page=0&name=FYLS-1206&okbutton=%CF%EE%E8%F1%EA+%EF%EE+%F1%EA%EB%E0%E4%F3
VT16-VT18 = PDTC114ET.215: NPN transistor with bias circuit
X14-X17 = DMR15F-HD

## Sheet sensors.SchDoc: SENSORS unit
size A2; DocumentNumber: UCNC.02.00.001
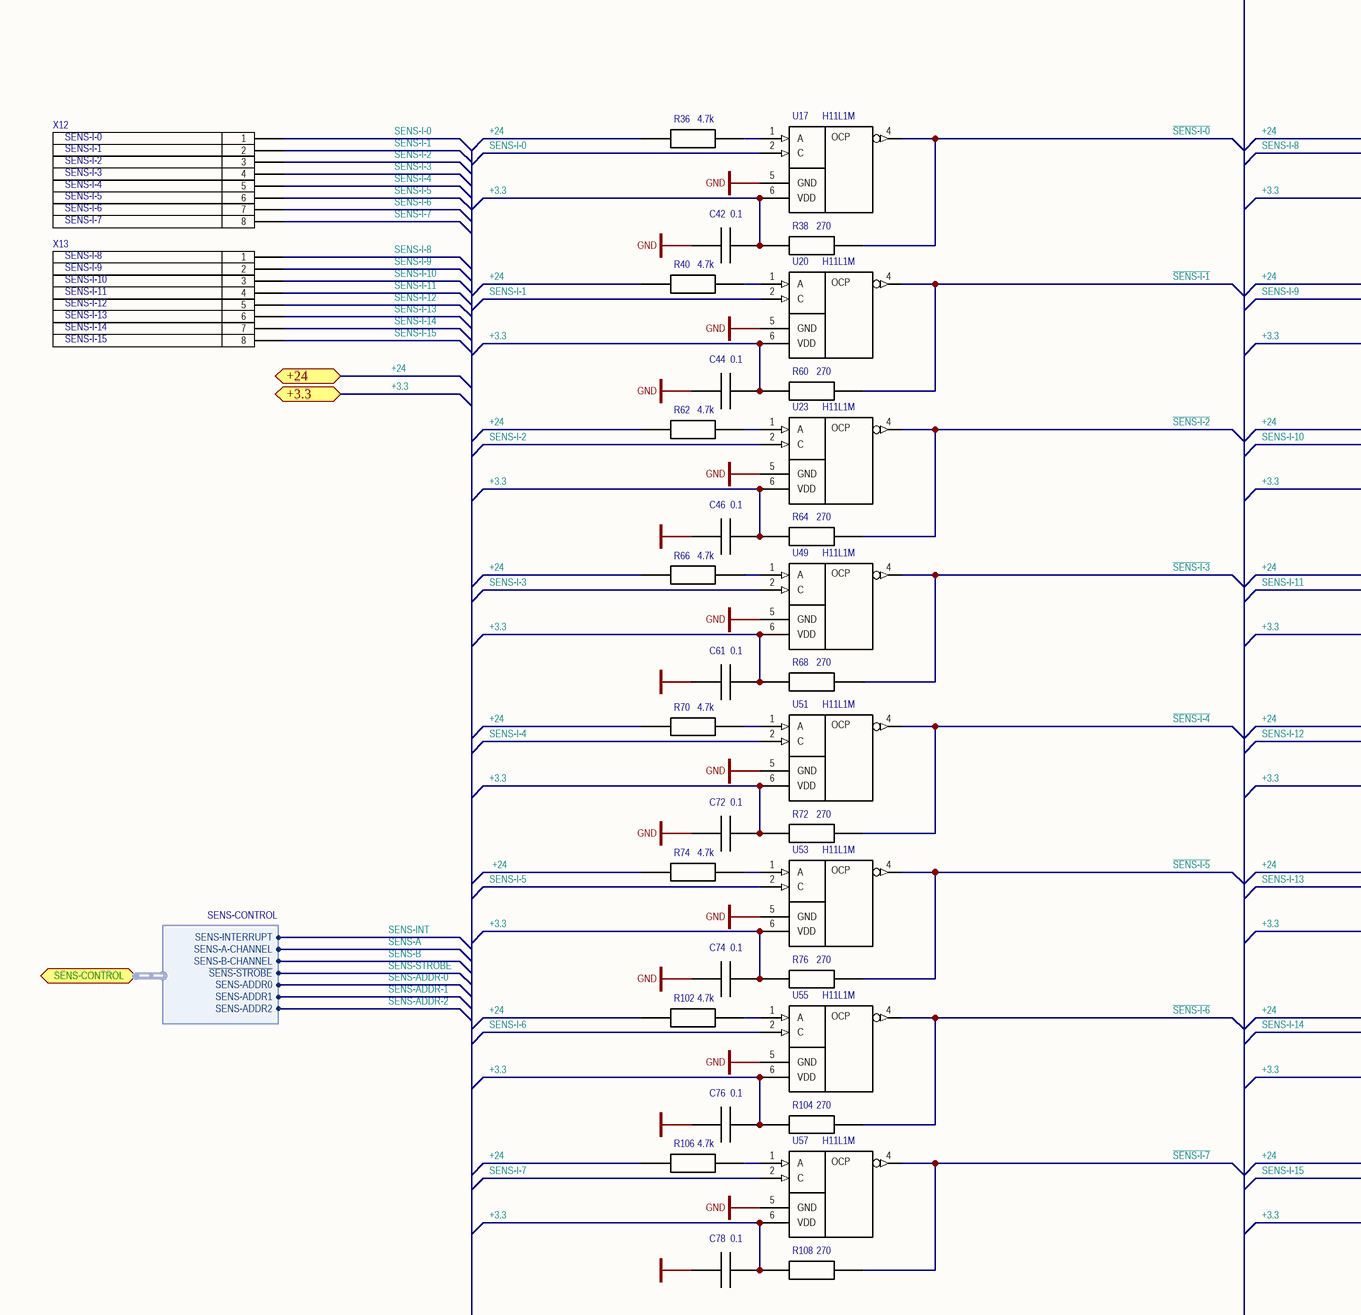
[diagram p4: sensors.SchDoc, top left]
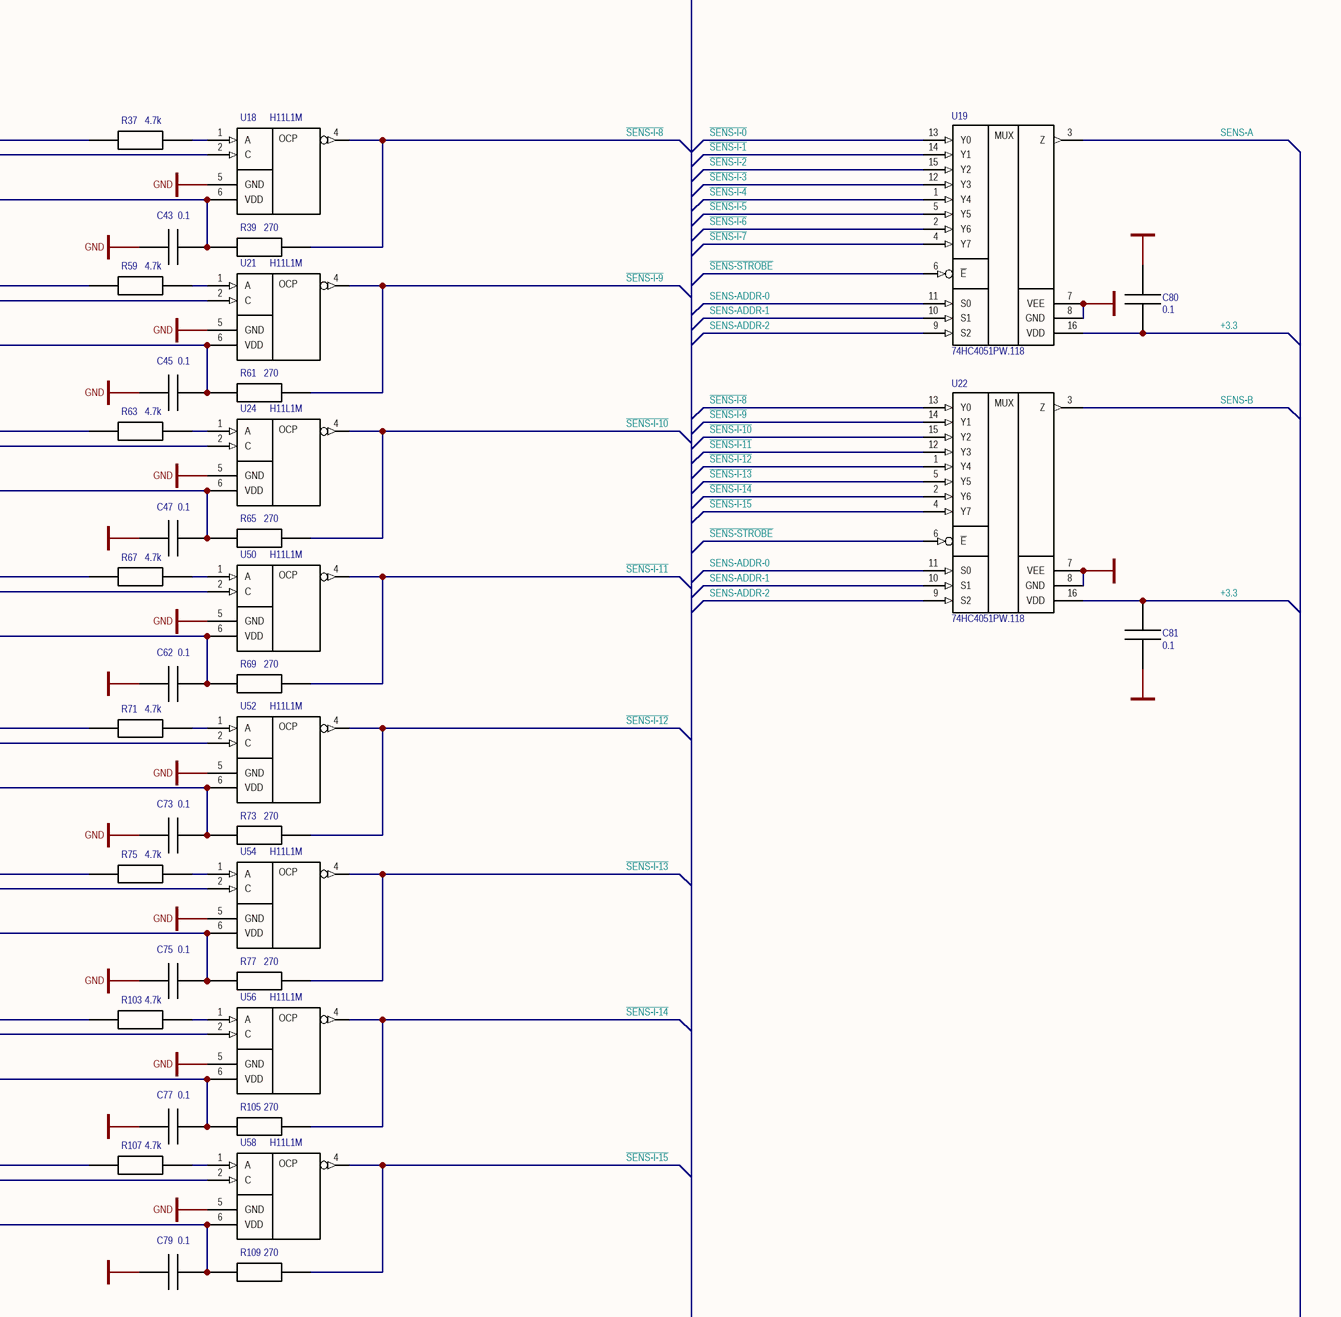
[diagram p5: sensors.SchDoc, top right]
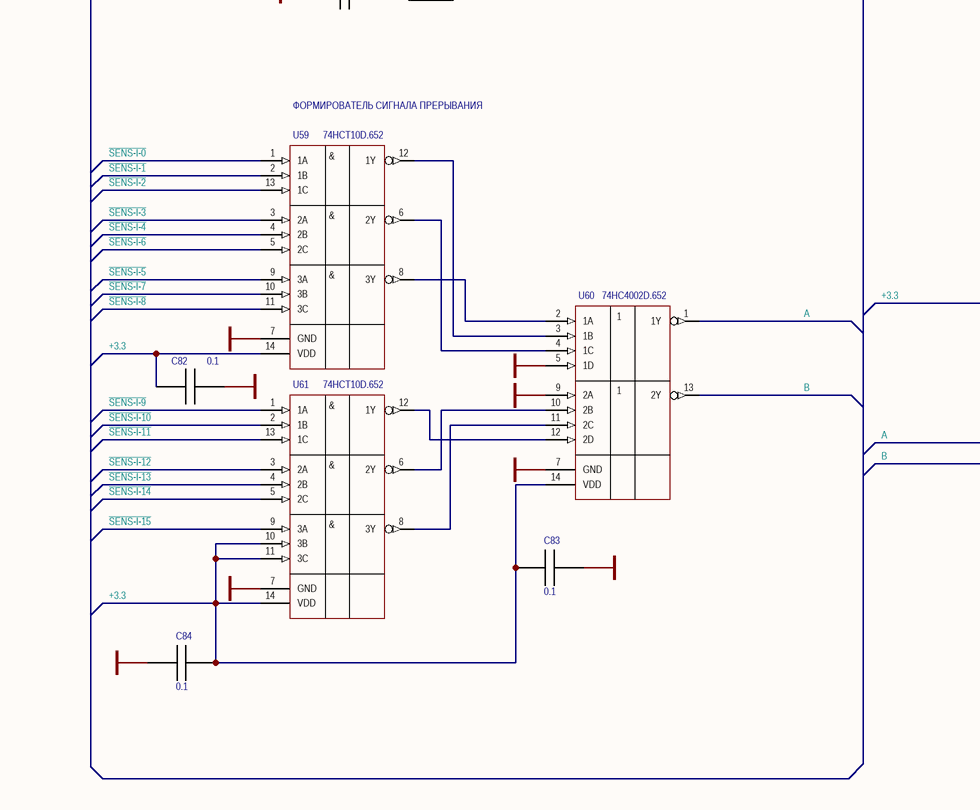
[diagram p6: sensors.SchDoc, bottom left]
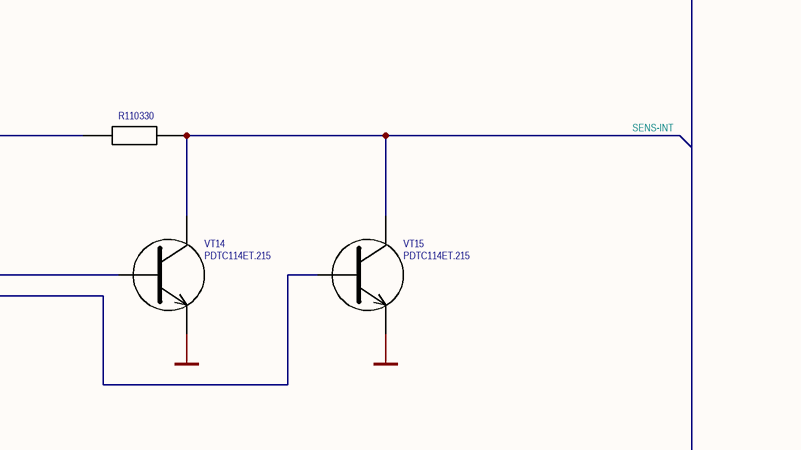
[diagram p7: sensors.SchDoc, bottom right]

### Parts
C42  0.1  [CAPC2012X04N]
C43  0.1  [CAPC2012X04N]
C44  0.1  [CAPC2012X04N]
C45  0.1  [CAPC2012X04N]
C46  0.1  [CAPC2012X04N]
C47  0.1  [CAPC2012X04N]
C61  0.1  [CAPC2012X04N]
C62  0.1  [CAPC2012X04N]
C72  0.1  [CAPC2012X04N]
C73  0.1  [CAPC2012X04N]
C74  0.1  [CAPC2012X04N]
C75  0.1  [CAPC2012X04N]
C76  0.1  [CAPC2012X04N]
C77  0.1  [CAPC2012X04N]
C78  0.1  [CAPC2012X04N]
C79  0.1  [CAPC2012X04N]
C80  0.1  [CAPC2012X04N]
C81  0.1  [CAPC2012X04N]
C82  0.1  [CAPC2012X04N]
C83  0.1  [CAPC2012X04N]
C84  0.1  [CAPC2012X04N]
R36  4.7k  [RESC2012X04N]
R37  4.7k  [RESC2012X04N]
R38  270  [RESC2012X04N]
R39  270  [RESC2012X04N]
R40  4.7k  [RESC2012X04N]
R59  4.7k  [RESC2012X04N]
R60  270  [RESC2012X04N]
R61  270  [RESC2012X04N]
R62  4.7k  [RESC2012X04N]
R63  4.7k  [RESC2012X04N]
R64  270  [RESC2012X04N]
R65  270  [RESC2012X04N]
R66  4.7k  [RESC2012X04N]
R67  4.7k  [RESC2012X04N]
R68  270  [RESC2012X04N]
R69  270  [RESC2012X04N]
R70  4.7k  [RESC2012X04N]
R71  4.7k  [RESC2012X04N]
R72  270  [RESC2012X04N]
R73  270  [RESC2012X04N]
R74  4.7k  [RESC2012X04N]
R75  4.7k  [RESC2012X04N]
R76  270  [RESC2012X04N]
R77  270  [RESC2012X04N]
R102  4.7k  [RESC2012X04N]
R103  4.7k  [RESC2012X04N]
R104  270  [RESC2012X04N]
R105  270  [RESC2012X04N]
R106  4.7k  [RESC2012X04N]
R107  4.7k  [RESC2012X04N]
R108  270  [RESC2012X04N]
R109  270  [RESC2012X04N]
R110  330  [RESC3216X05N]
U17  H11L1M  [DIP6]
U18  H11L1M  [DIP6]
U19  74HC4051PW.118  [TSOP65P640X120-16N]
U20  H11L1M  [DIP6]
U21  H11L1M  [DIP6]
U22  74HC4051PW.118  [TSOP65P640X120-16N]
U23  H11L1M  [DIP6]
U24  H11L1M  [DIP6]
U49  H11L1M  [DIP6]
U50  H11L1M  [DIP6]
U51  H11L1M  [DIP6]
U52  H11L1M  [DIP6]
U53  H11L1M  [DIP6]
U54  H11L1M  [DIP6]
U55  H11L1M  [DIP6]
U56  H11L1M  [DIP6]
U57  H11L1M  [DIP6]
U58  H11L1M  [DIP6]
U59  74HCT10D.652  [SOIC127P600X175-14N]
U60  74HC4002D.652  [SOIC127P600X175-14N]
U61  74HCT10D.652  [SOIC127P600X175-14N]
VT14  PDTC114ET.215  [SOT95P238X102-3N]
VT15  PDTC114ET.215  [SOT95P238X102-3N]
X12  MINI-FIT-8-WAY-M  [MINI-FIT-8-WAY-SM]  (value not drawn)
X13  MINI-FIT-8-WAY-M  [MINI-FIT-8-WAY-SM]  (value not drawn)

### Ports
+3.3, +24, SENS-CONTROL (harness SENS-CONTROL)

### Harnesses
SENS-CONTROL: SENS-INTERRUPT, SENS-A-CHANNEL, SENS-B-CHANNEL, ~{SENS-STROBE}, SENS-ADDR0, SENS-ADDR1, SENS-ADDR2

### Nets
GND: C42.1 C43.1 C44.1 C45.1 C46.1 C47.1 C61.1 C62.1 C72.1 C73.1 C74.1 C75.1 C76.1 C77.1 C78.1 C79.1 C80.2 C81.1 C82.2 C83.2 C84.1 U17.5(GND) U18.5(GND) U19.7(VEE) U19.8(GND) U20.5(GND) U21.5(GND) U22.7(VEE) U22.8(GND) U23.5(GND) U24.5(GND) U49.5(GND) U50.5(GND) U51.5(GND) U52.5(GND) U53.5(GND) U54.5(GND) U55.5(GND) U56.5(GND) U57.5(GND) U58.5(GND) U59.7(GND) U60.5(1D) U60.7(GND) U60.9(2A) U61.7(GND) VT14.2(E) VT15.2(E)
+3.3: C42.2 C43.2 C44.2 C45.2 C46.2 C47.2 C61.2 C62.2 C72.2 C73.2 C74.2 C75.2 C76.2 C77.2 C78.2 C79.2 C80.1 C81.2 C82.1 C83.1 C84.2 R38.1 R39.1 R60.1 R61.1 R64.1 R65.1 R68.1 R69.1 R72.1 R73.1 R76.1 R77.1 R104.1 R105.1 R108.1 R109.1 R110.1 U17.6(VDD) U18.6(VDD) U19.16(VDD) U20.6(VDD) U21.6(VDD) U22.16(VDD) U23.6(VDD) U24.6(VDD) U49.6(VDD) U50.6(VDD) U51.6(VDD) U52.6(VDD) U53.6(VDD) U54.6(VDD) U55.6(VDD) U56.6(VDD) U57.6(VDD) U58.6(VDD) U59.14(VDD) U60.14(VDD) U61.10(3B) U61.11(3C) U61.14(VDD) ; port +3.3
+24: R36.1 R37.1 R40.1 R59.1 R62.1 R63.1 R66.1 R67.1 R70.1 R71.1 R74.1 R75.1 R102.1 R103.1 R106.1 R107.1 ; port +24
A: U60.1(1Y) VT14.1(B)
B: U60.13(2Y) VT15.1(B)
~{SENS-I-0}: R38.2 U17.4(OUT) U19.13(Y0) U59.1(1A)
~{SENS-I-1}: R60.2 U19.14(Y1) U20.4(OUT) U59.2(1B)
~{SENS-I-10}: R65.2 U22.15(Y2) U24.4(OUT) U61.2(1B)
~{SENS-I-11}: R69.2 U22.12(Y3) U50.4(OUT) U61.13(1C)
~{SENS-I-12}: R73.2 U22.1(Y4) U52.4(OUT) U61.3(2A)
~{SENS-I-13}: R77.2 U22.5(Y5) U54.4(OUT) U61.4(2B)
~{SENS-I-14}: R105.2 U22.2(Y6) U56.4(OUT) U61.5(2C)
~{SENS-I-15}: R109.2 U22.4(Y7) U58.4(OUT) U61.9(3A)
~{SENS-I-2}: R64.2 U19.15(Y2) U23.4(OUT) U59.13(1C)
~{SENS-I-3}: R68.2 U19.12(Y3) U49.4(OUT) U59.3(2A)
~{SENS-I-4}: R72.2 U19.1(Y4) U51.4(OUT) U59.4(2B)
~{SENS-I-5}: R76.2 U19.5(Y5) U53.4(OUT) U59.9(3A)
~{SENS-I-6}: R104.2 U19.2(Y6) U55.4(OUT) U59.5(2C)
~{SENS-I-7}: R108.2 U19.4(Y7) U57.4(OUT) U59.10(3B)
~{SENS-I-8}: R39.2 U18.4(OUT) U22.13(Y0) U59.11(3C)
~{SENS-I-9}: R61.2 U21.4(OUT) U22.14(Y1) U61.1(1A)
~{SENS-STROBE}: U19.6(~{E}) U22.6(~{E}) ; port SENS-CONTROL.~{SENS-STROBE}  [project net CPU56]
SENS-A: U19.3(Z) ; port SENS-CONTROL.SENS-A-CHANNEL  [project net CPU54]
SENS-ADDR-0: U19.11(S0) U22.11(S0) ; port SENS-CONTROL.SENS-ADDR0  [project net CPU57]
SENS-ADDR-1: U19.10(S1) U22.10(S1) ; port SENS-CONTROL.SENS-ADDR1  [project net CPU58]
SENS-ADDR-2: U19.9(S2) U22.9(S2) ; port SENS-CONTROL.SENS-ADDR2  [project net CPU59]
SENS-B: U22.3(Z) ; port SENS-CONTROL.SENS-B-CHANNEL  [project net CPU55]
SENS-I-0: U17.2(C) X12.1
SENS-I-1: U20.2(C) X12.2
SENS-I-2: U23.2(C) X12.3
SENS-I-3: U49.2(C) X12.4
SENS-I-4: U51.2(C) X12.5
SENS-I-5: U53.2(C) X12.6
SENS-I-6: U55.2(C) X12.7
SENS-I-7: U57.2(C) X12.8
SENS-I-8: U18.2(C) X13.1
SENS-I-9: U21.2(C) X13.2
SENS-I-10: U24.2(C) X13.3
SENS-I-11: U50.2(C) X13.4
SENS-I-12: U52.2(C) X13.5
SENS-I-13: U54.2(C) X13.6
SENS-I-14: U56.2(C) X13.7
SENS-I-15: U58.2(C) X13.8
SENS-INT: R110.2 VT14.3(C) VT15.3(C) ; port SENS-CONTROL.SENS-INTERRUPT  [project net CPU53]
NetR36_2: R36.2 U17.1(A)
NetR37_2: R37.2 U18.1(A)
NetR40_2: R40.2 U20.1(A)
NetR59_2: R59.2 U21.1(A)
NetR62_2: R62.2 U23.1(A)
NetR63_2: R63.2 U24.1(A)
NetR66_2: R66.2 U49.1(A)
NetR67_2: R67.2 U50.1(A)
NetR70_2: R70.2 U51.1(A)
NetR71_2: R71.2 U52.1(A)
NetR74_2: R74.2 U53.1(A)
NetR75_2: R75.2 U54.1(A)
NetR102_2: R102.2 U55.1(A)
NetR103_2: R103.2 U56.1(A)
NetR106_2: R106.2 U57.1(A)
NetR107_2: R107.2 U58.1(A)
NetU59_6: U59.6(2Y) U60.4(1C)
NetU59_8: U59.8(3Y) U60.2(1A)
NetU59_12: U59.12(1Y) U60.3(1B)
NetU60_10: U60.10(2B) U61.6(2Y)
NetU60_11: U60.11(2C) U61.8(3Y)
NetU60_12: U60.12(2D) U61.12(1Y)

### Notes on the sheet
- SENS-I-0
- SENS-I-1
- SENS-I-2
- SENS-I-3
- SENS-I-4
- SENS-I-5
- SENS-I-6
- SENS-I-7
- SENS-I-8
- SENS-I-9
- SENS-I-10
- SENS-I-11
- SENS-I-12
- SENS-I-13
- SENS-I-14
- SENS-I-15
- (near U59) ФОРМИРОВАТЕЛЬ СИГНАЛА ПРЕРЫВАНИЯ
- (in symbol 74HC4051PW.118) MUX
- (in symbol 74HCT10D.652) &
- (in symbol H11L1M) OCP

### Library data of the parts
C42-C47 C61 C62 C72-C84 = C: SMD конденсатор; Ref: http://www.kosmodrom.com.ua/prodlist.php?name=cap1206
R36-R40 R59-R77 R102-R110 = R: SMD резистор; Ref: http://www.kosmodrom.com.ua/prodlist.php?name=res1206
U17 U18 U20 U21 U23 U24 U49-U58 = H11L1M: as U27 on sheet servo; Ref: http://www.kosmodrom.com.ua/el.php?name=H11L1M
VT14 VT15 = PDTC114ET.215: NPN transistor with bias circuit

## Sheet euromap.SchDoc: EUROMAP interface
size A2; DrawnBy: Sergey Dytiuk (Ulysses); Engineer: Sergey Dytiuk; DocumentNumber: UCNC.01.00.001; SheetNumber: 1; SheetTotal: 1
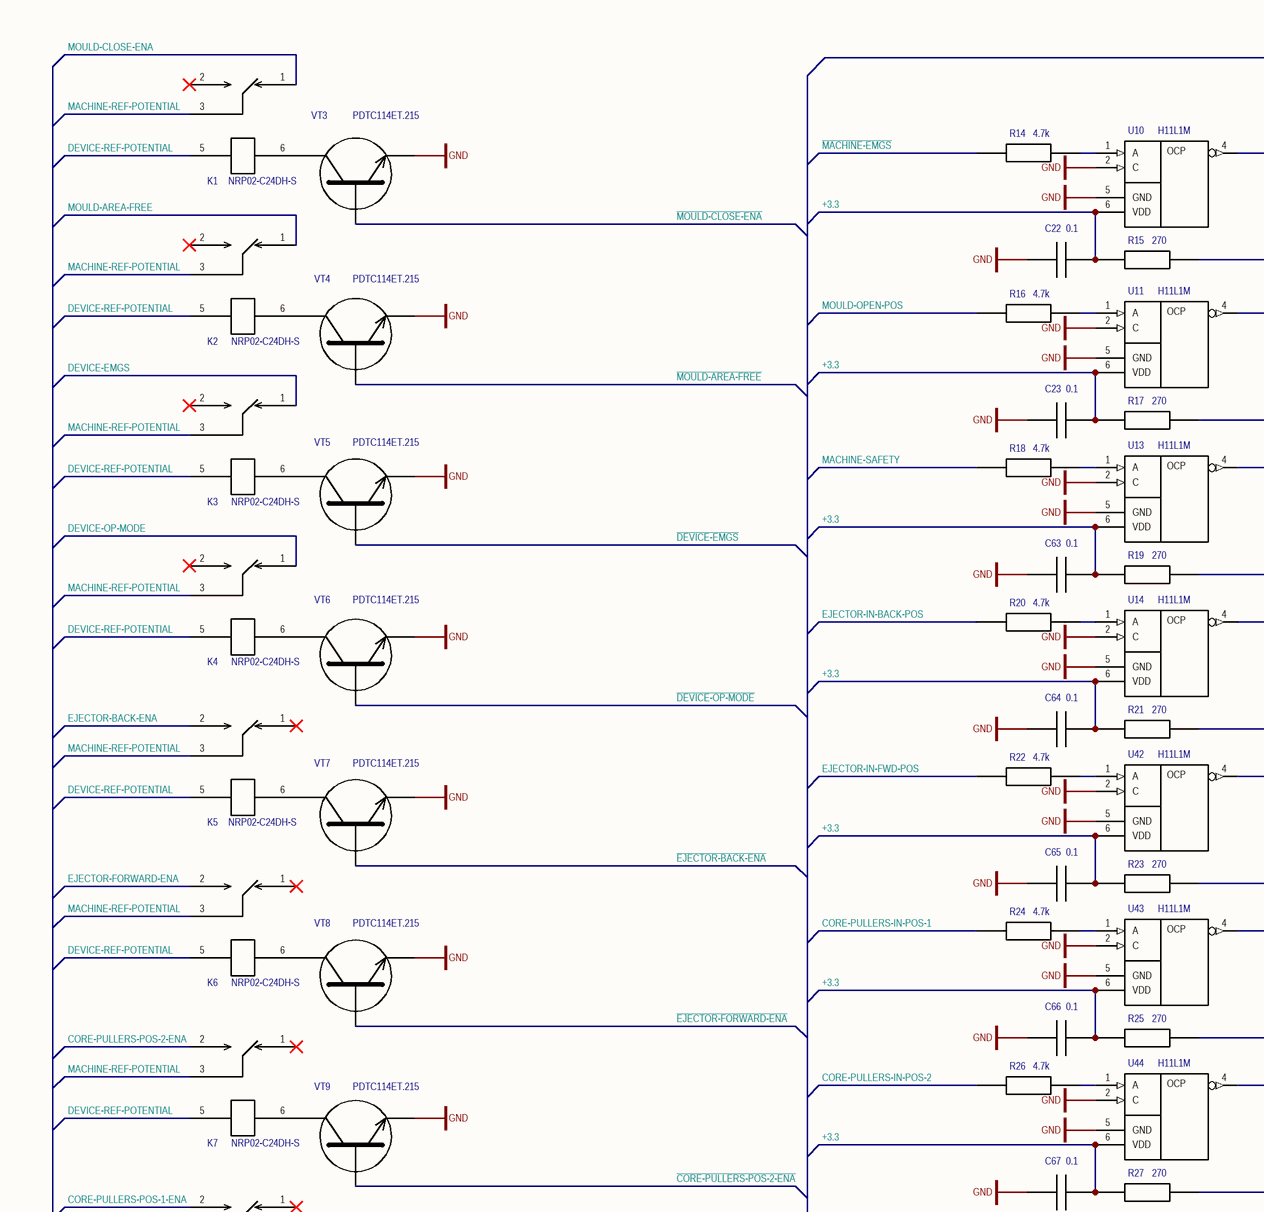
[diagram p8: euromap.SchDoc, top left]
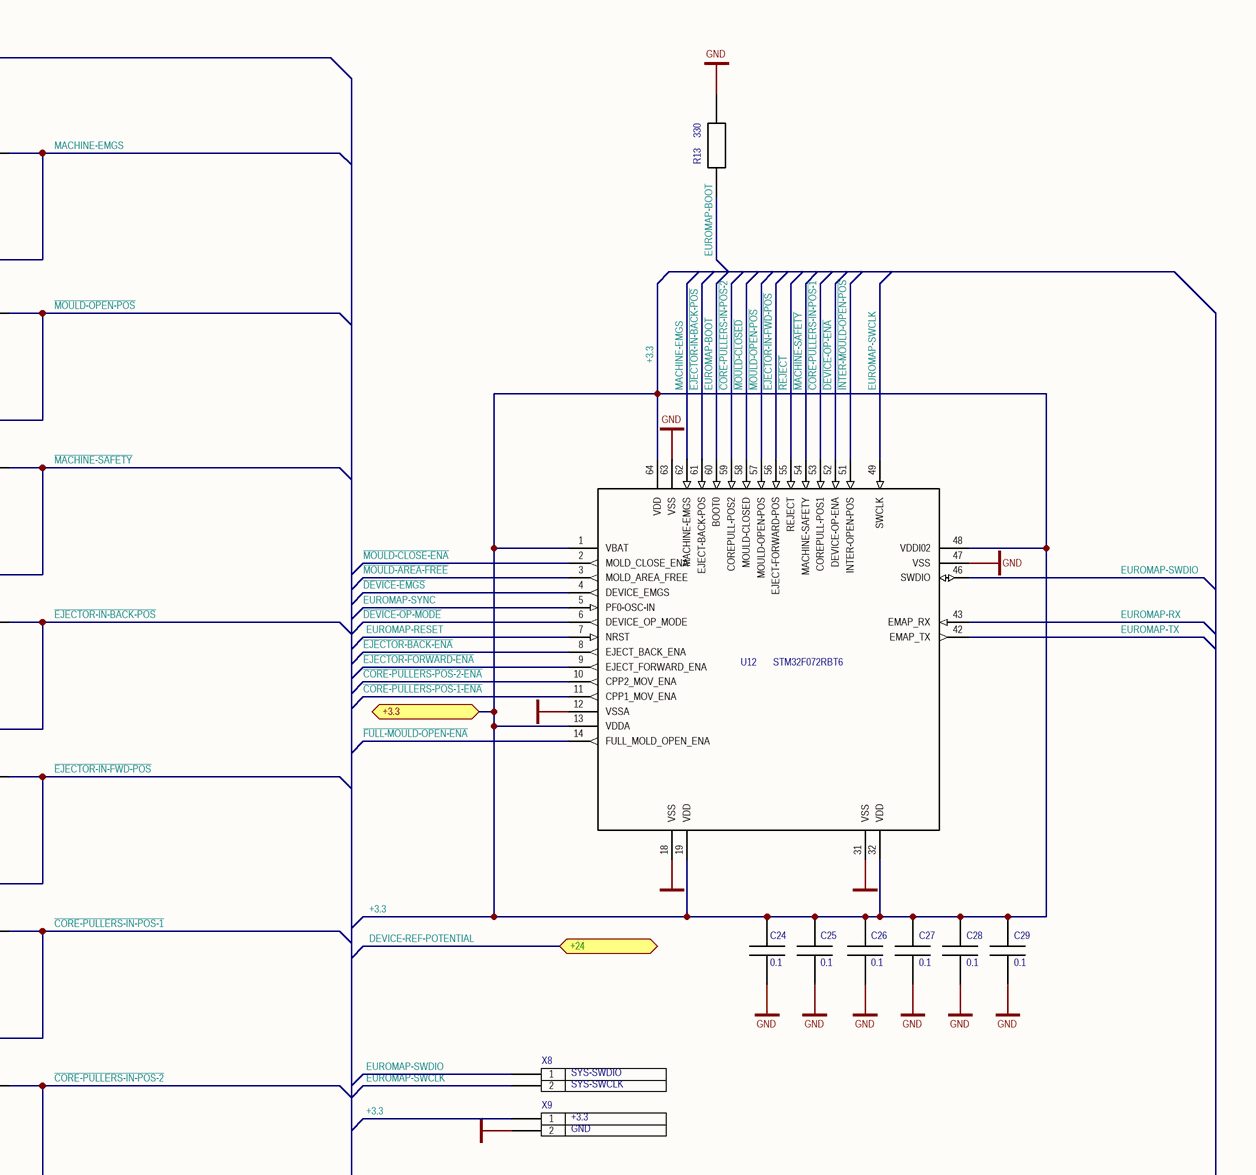
[diagram p9: euromap.SchDoc, top right]
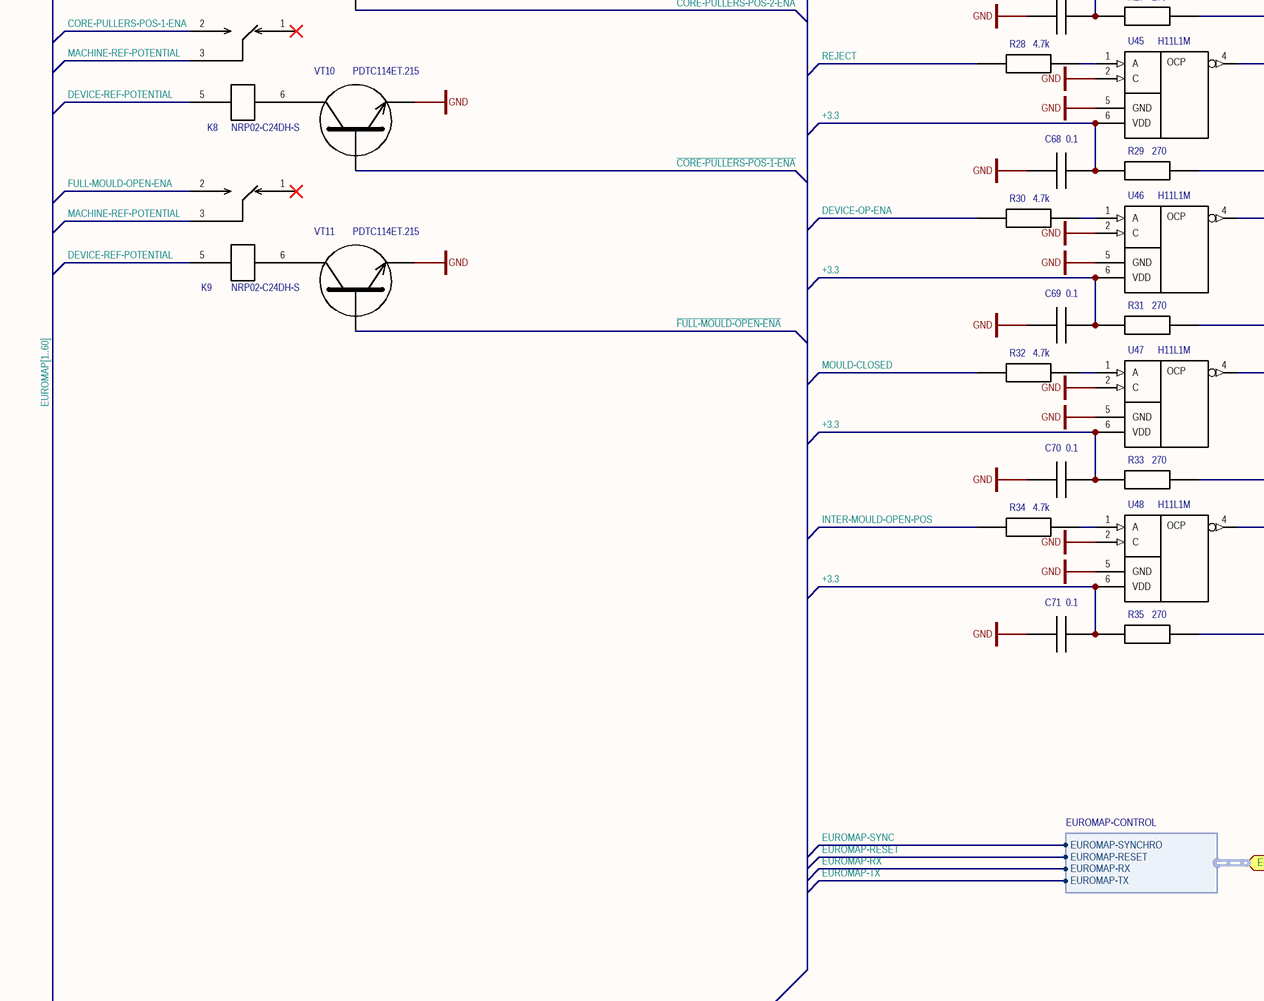
[diagram p10: euromap.SchDoc, bottom left]
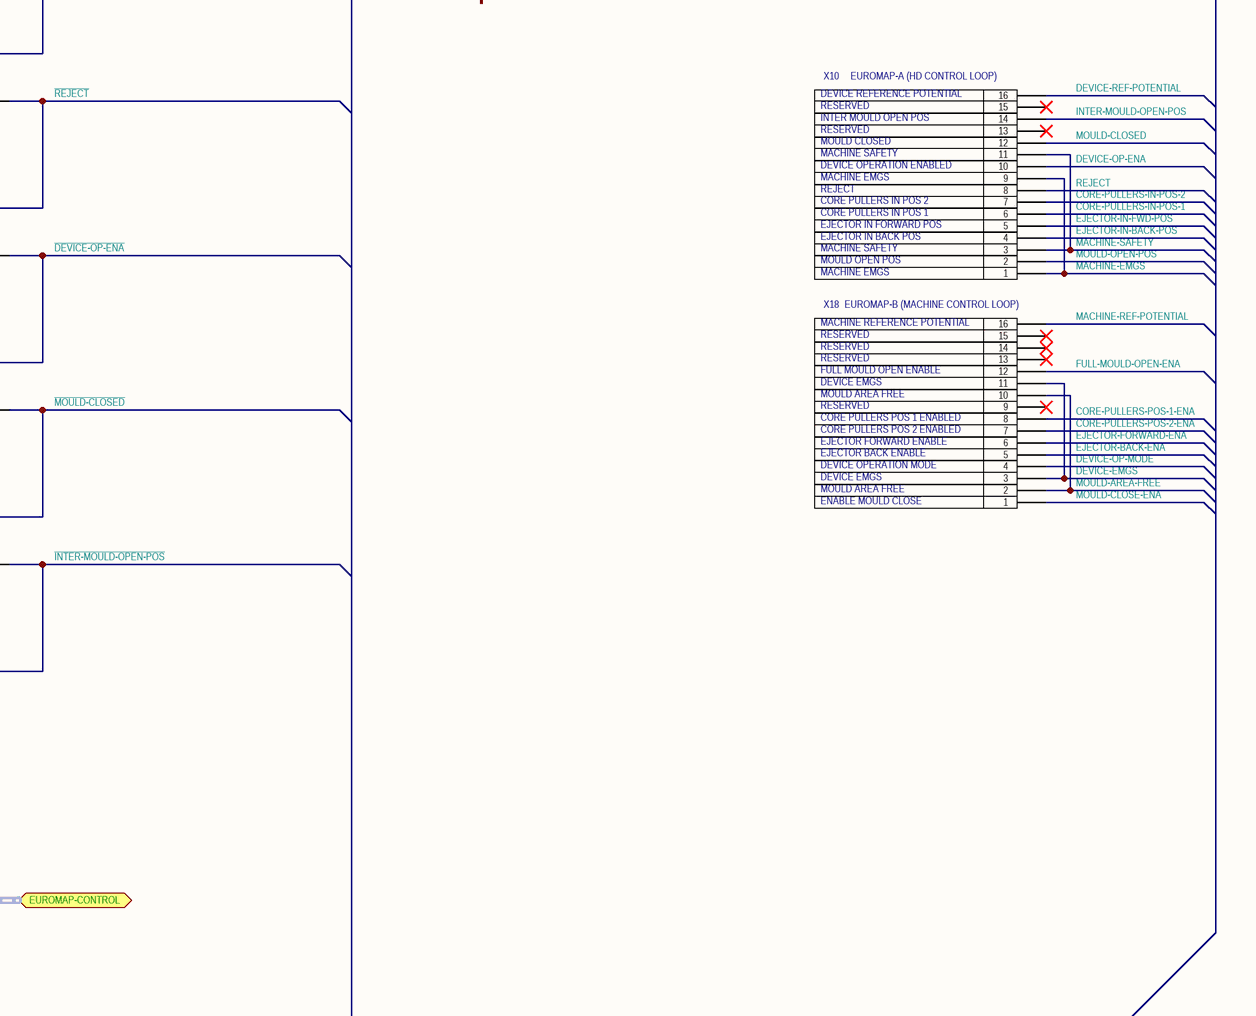
[diagram p11: euromap.SchDoc, bottom right]

### Parts
C22  0.1  [CAPC2012X04N]
C23  0.1  [CAPC2012X04N]
C24  0.1  [CAPC1608X05N]
C25  0.1  [CAPC1608X05N]
C26  0.1  [CAPC1608X05N]
C27  0.1  [CAPC1608X05N]
C28  0.1  [CAPC1608X05N]
C29  0.1  [CAPC1608X05N]
C63  0.1  [CAPC2012X04N]
C64  0.1  [CAPC2012X04N]
C65  0.1  [CAPC2012X04N]
C66  0.1  [CAPC2012X04N]
C67  0.1  [CAPC2012X04N]
C68  0.1  [CAPC2012X04N]
C69  0.1  [CAPC2012X04N]
C70  0.1  [CAPC2012X04N]
C71  0.1  [CAPC2012X04N]
K1  NRP02-C24DH-S  [R_NRP02]
K2  NRP02-C24DH-S  [R_NRP02]
K3  NRP02-C24DH-S  [R_NRP02]
K4  NRP02-C24DH-S  [R_NRP02]
K5  NRP02-C24DH-S  [R_NRP02]
K6  NRP02-C24DH-S  [R_NRP02]
K7  NRP02-C24DH-S  [R_NRP02]
K8  NRP02-C24DH-S  [R_NRP02]
K9  NRP02-C24DH-S  [R_NRP02]
R13  330  [RESC1608X05N]
R14  4.7k  [RESC2012X04N]
R15  270  [RESC2012X04N]
R16  4.7k  [RESC2012X04N]
R17  270  [RESC2012X04N]
R18  4.7k  [RESC2012X04N]
R19  270  [RESC2012X04N]
R20  4.7k  [RESC2012X04N]
R21  270  [RESC2012X04N]
R22  4.7k  [RESC2012X04N]
R23  270  [RESC2012X04N]
R24  4.7k  [RESC2012X04N]
R25  270  [RESC2012X04N]
R26  4.7k  [RESC2012X04N]
R27  270  [RESC2012X04N]
R28  4.7k  [RESC2012X04N]
R29  270  [RESC2012X04N]
R30  4.7k  [RESC2012X04N]
R31  270  [RESC2012X04N]
R32  4.7k  [RESC2012X04N]
R33  270  [RESC2012X04N]
R34  4.7k  [RESC2012X04N]
R35  270  [RESC2012X04N]
U10  H11L1M  [DIP6]
U11  H11L1M  [DIP6]
U12  STM32F072RBT6  [TSQFP50P1200X1200X160-64N]
U13  H11L1M  [DIP6]
U14  H11L1M  [DIP6]
U42  H11L1M  [DIP6]
U43  H11L1M  [DIP6]
U44  H11L1M  [DIP6]
U45  H11L1M  [DIP6]
U46  H11L1M  [DIP6]
U47  H11L1M  [DIP6]
U48  H11L1M  [DIP6]
VT3  PDTC114ET.215  [SOT95P238X102-3N]
VT4  PDTC114ET.215  [SOT95P238X102-3N]
VT5  PDTC114ET.215  [SOT95P238X102-3N]
VT6  PDTC114ET.215  [SOT95P238X102-3N]
VT7  PDTC114ET.215  [SOT95P238X102-3N]
VT8  PDTC114ET.215  [SOT95P238X102-3N]
VT9  PDTC114ET.215  [SOT95P238X102-3N]
VT10  PDTC114ET.215  [SOT95P238X102-3N]
VT11  PDTC114ET.215  [SOT95P238X102-3N]
X8  Jamper ZL201  [ZL201-2]  (value not drawn)
X9  Jamper ZL201  [ZL201-2]  (value not drawn)
X10  EUROMAP-A (HD CONTROL LOOP)  [MINI-FIT-16-WAY-M]
X18  EUROMAP-B (MACHINE CONTROL LOOP)  [MINI-FIT-16-WAY-M]

### Ports
+3.3, +24, EUROMAP-CONTROL (harness EUROMAP-CONTROL)

### Harnesses
EUROMAP-CONTROL: EUROMAP-SYNCHRO, EUROMAP-RESET, EUROMAP-RX, EUROMAP-TX

### Nets
GND: C22.1 C23.1 C24.1 C25.1 C26.1 C27.1 C28.1 C29.1 C63.1 C64.1 C65.1 C66.1 C67.1 C68.1 C69.1 C70.1 C71.1 R13.1 U10.2(C) U10.5(GND) U11.2(C) U11.5(GND) U12.12(VSSA) U12.18(VSS) U12.31(VSS) U12.47(VSS) U12.63(VSS) U13.2(C) U13.5(GND) U14.2(C) U14.5(GND) U42.2(C) U42.5(GND) U43.2(C) U43.5(GND) U44.2(C) U44.5(GND) U45.2(C) U45.5(GND) U46.2(C) U46.5(GND) U47.2(C) U47.5(GND) U48.2(C) U48.5(GND) VT3.2(E) VT4.2(E) VT5.2(E) VT6.2(E) VT7.2(E) VT8.2(E) VT9.2(E) VT10.2(E) VT11.2(E) X9.2
+3.3: C22.2 C23.2 C24.2 C25.2 C26.2 C27.2 C28.2 C29.2 C63.2 C64.2 C65.2 C66.2 C67.2 C68.2 C69.2 C70.2 C71.2 R15.1 R17.1 R19.1 R21.1 R23.1 R25.1 R27.1 R29.1 R31.1 R33.1 R35.1 U10.6(VDD) U11.6(VDD) U12.1(VBAT) U12.13(VDDA) U12.19(VDD) U12.32(VDD) U12.48(VDDI02) U12.64(VDD) U13.6(VDD) U14.6(VDD) U42.6(VDD) U43.6(VDD) U44.6(VDD) U45.6(VDD) U46.6(VDD) U47.6(VDD) U48.6(VDD) X9.1 ; port +3.3
~{CORE-PULLERS-IN-POS-1}: R25.2 U12.53(COREPULL-POS1) U43.4(OUT)
~{CORE-PULLERS-IN-POS-2}: R27.2 U12.59(COREPULL-POS2) U44.4(OUT)
~{CORE-PULLERS-POS-1-ENA}: U12.11(CPP1_MOV_ENA) VT10.1(B)
~{CORE-PULLERS-POS-2-ENA}: U12.10(CPP2_MOV_ENA) VT9.1(B)
CORE-PULLERS-IN-POS-1: R24.1 X10.6
CORE-PULLERS-IN-POS-2: R26.1 X10.7
CORE-PULLERS-POS-1-ENA: K8.2 X18.8
CORE-PULLERS-POS-2-ENA: K7.2 X18.7
~{DEVICE-EMGS}: U12.4(DEVICE_EMGS) VT5.1(B)
~{DEVICE-OP-ENA}: R31.2 U12.52(DEVICE-OP-ENA) U46.4(OUT)
~{DEVICE-OP-MODE}: U12.6(DEVICE_OP_MODE) VT6.1(B)
DEVICE-EMGS: K3.1 X18.3 X18.11
DEVICE-OP-ENA: R30.1 X10.10
DEVICE-OP-MODE: K4.1 X18.4
DEVICE-REF-POTENTIAL: K1.5 K2.5 K3.5 K4.5 K5.5 K6.5 K7.5 K8.5 K9.5 X10.16 ; port +24  [project net +24]
~{EJECTOR-BACK-ENA}: U12.8(EJECT_BACK_ENA) VT7.1(B)
~{EJECTOR-FORWARD-ENA}: U12.9(EJECT_FORWARD_ENA) VT8.1(B)
~{EJECTOR-IN-BACK-POS}: R21.2 U12.61(EJECT-BACK-POS) U14.4(OUT)
~{EJECTOR-IN-FWD-POS}: R23.2 U12.56(EJECT-FORWARD-POS) U42.4(OUT)
EJECTOR-BACK-ENA: K5.2 X18.5
EJECTOR-FORWARD-ENA: K6.2 X18.6
EJECTOR-IN-BACK-POS: R20.1 X10.4
EJECTOR-IN-FWD-POS: R22.1 X10.5
EUROMAP-BOOT: R13.2 U12.60(BOOT0)
EUROMAP-RESET: U12.7(NRST) ; port EUROMAP-CONTROL.EUROMAP-RESET  [project net CPU61]
EUROMAP-RX: U12.43(EMAP_RX) ; port EUROMAP-CONTROL.EUROMAP-RX  [project net CPU62]
EUROMAP-SWCLK: U12.49(SWCLK) X8.2
EUROMAP-SWDIO: U12.46(SWDIO) X8.1
EUROMAP-SYNC: U12.5(PF0-OSC-IN) ; port EUROMAP-CONTROL.EUROMAP-SYNCHRO  [project net CPU60]
EUROMAP-TX: U12.42(EMAP_TX) ; port EUROMAP-CONTROL.EUROMAP-TX  [project net CPU63]
~{FULL-MOULD-OPEN-ENA}: U12.14(FULL_MOLD_OPEN_ENA) VT11.1(B)
FULL-MOULD-OPEN-ENA: K9.2 X18.12
~{INTER-MOULD-OPEN-POS}: R35.2 U12.51(INTER-OPEN-POS) U48.4(OUT)
INTER-MOULD-OPEN-POS: R34.1 X10.14
~{MACHINE-EMGS}: R14.1
~{MACHINE-SAFETY}: R19.2 U12.54(MACHINE-SAFETY) U13.4(OUT)
~{MOULD-AREA-FREE}: U12.3(MOLD_AREA_FREE) VT4.1(B)
~{MOULD-CLOSE-ENA}: U12.2(MOLD_CLOSE_ENA) VT3.1(B)
~{MOULD-CLOSED}: R33.2 U12.58(MOULD-CLOSED) U47.4(OUT)
~{MOULD-OPEN-POS}: R17.2 U11.4(OUT) U12.57(MOULD-OPEN-POS)
MACHINE-EMGS: R15.2 U10.4(OUT) U12.62(MACHINE-EMGS) X10.1 X10.9
MACHINE-REF-POTENTIAL: K1.3 K2.3 K3.3 K4.3 K5.3 K6.3 K7.3 K8.3 K9.3 X18.16
MACHINE-SAFETY: R18.1 X10.3 X10.11
MOULD-AREA-FREE: K2.1 X18.2 X18.10
MOULD-CLOSE-ENA: K1.1 X18.1
MOULD-CLOSED: R32.1 X10.12
MOULD-OPEN-POS: R16.1 X10.2
~{REJECT}: R29.2 U12.55(REJECT) U45.4(OUT)
REJECT: R28.1 X10.8
NetK1_6: K1.6 VT3.3(C)
NetK2_6: K2.6 VT4.3(C)
NetK3_6: K3.6 VT5.3(C)
NetK4_6: K4.6 VT6.3(C)
NetK5_6: K5.6 VT7.3(C)
NetK6_6: K6.6 VT8.3(C)
NetK7_6: K7.6 VT9.3(C)
NetK8_6: K8.6 VT10.3(C)
NetK9_6: K9.6 VT11.3(C)
NetR14_2: R14.2 U10.1(A)
NetR16_2: R16.2 U11.1(A)
NetR18_2: R18.2 U13.1(A)
NetR20_2: R20.2 U14.1(A)
NetR22_2: R22.2 U42.1(A)
NetR24_2: R24.2 U43.1(A)
NetR26_2: R26.2 U44.1(A)
NetR28_2: R28.2 U45.1(A)
NetR30_2: R30.2 U46.1(A)
NetR32_2: R32.2 U47.1(A)
NetR34_2: R34.2 U48.1(A)

Not connected (* = marked no-connect by the designer): K1 2*; K2 2*; K3 2*; K4 2*; K5 1*; K6 1*; K7 1*; K8 1*; K9 1*; U12 15(PA1) 16(PA2) 17(PA3) 20(PA4) 21(PA5) 22(PA6) 23(PA7) 24(PC4) 25(PC5) 26(PB0) 27(PB1) 28(PB2) 29(PB10) 30(PB11) 33(PB12) 34(PB13) 35(PB14) 36(PB15) 37(PC6) 38(PC7) 39(PC8) 40(PC9) 41(PA8) 44(PA11) 45(PA12) 50(PA15); X10 13* 15*; X18 9* 13* 14* 15*

### Buses and harness runs
bus EUROMAP[1..60]

### Notes on the sheet
- SYS-SWDIO
- SYS-SWCLK
- +3.3
- GND
- RESERVED
- INTER MOULD OPEN POS
- (near X10) DEVICE REFERENCE POTENTIAL
- MACHINE EMGS
- MACHINE SAFETY
- CORE PULLERS IN POS 2
- REJECT
- DEVICE OPERATION ENABLED
- MOULD CLOSED
- MOULD OPEN POS
- EJECTOR IN BACK POS
- EJECTOR IN FORWARD POS
- CORE PULLERS IN POS 1
- MACHINE REFERENCE POTENTIAL
- MOULD AREA FREE
- DEVICE EMGS
- (near X18) CORE PULLERS POS 2 ENABLED
- (near X18) CORE PULLERS POS 1 ENABLED
- FULL MOULD OPEN ENABLE
- ENABLE MOULD CLOSE
- DEVICE OPERATION MODE
- EJECTOR BACK ENABLE
- EJECTOR FORWARD ENABLE
- (in symbol H11L1M) OCP

### Library data of the parts
C22-C29 C63-C71 = C: SMD конденсатор; Ref: http://www.kosmodrom.com.ua/prodlist.php?name=cap1206
K1-K9 = NRP02-C24DH-S: Электромеханическое реле
R13-R35 = R: SMD резистор; Ref: http://www.kosmodrom.com.ua/prodlist.php?name=res1206
U10 U11 U13 U14 U42-U48 = H11L1M: as U27 on sheet servo; Ref: http://www.kosmodrom.com.ua/el.php?name=H11L1M
U12 = STM32F072RBT6: Микроконтроллер
VT3-VT11 = PDTC114ET.215: NPN transistor with bias circuit
X10 X18 = MINI-FIT-16-WAY-M

## Nets that join several sheets
GND: cpu (62 pins), power (15 pins), servo (45 pins), sensors (48 pins), euromap (55 pins)
+3.3: cpu (35 pins), power (5 pins), servo (44 pins), sensors (61 pins), euromap (46 pins)
+24: power (5 pins), servo (12 pins), sensors (16 pins), euromap (10 pins)
CPU18: power (5 pins), servo (X14.12 X15.12 X16.12 X17.12)
CPU41: cpu (U3.63), servo (U26.5)
CPU42: cpu (U3.39), servo (U29.5)
CPU43: cpu (U3.46), servo (U32.5)
CPU44: cpu (U3.4), servo (U36.5)
CPU45: cpu (U3.41), servo (R81.2 U28.4)
CPU46: cpu (U3.42), servo (R85.2 U34.4)
CPU47: cpu (U3.43), servo (R90.2 U38.4)
CPU48: cpu (U3.44), servo (R94.2 U41.4)
CPU49: cpu (U3.40), servo (U39.12)
CPU50: cpu (U3.54), servo (U25.14)
CPU51: cpu (U3.52), servo (8 pins)
CPU52: cpu (U3.51), servo (VT16.1)
CPU53: cpu (U3.9), sensors (R110.2 VT14.3 VT15.3)
CPU54: cpu (U3.7), sensors (U19.3)
CPU55: cpu (U3.8), sensors (U22.3)
CPU56: cpu (U3.15), sensors (U19.6 U22.6)
CPU57: cpu (U3.16), sensors (U19.11 U22.11)
CPU58: cpu (U3.17), sensors (U19.10 U22.10)
CPU59: cpu (U3.18), sensors (U19.9 U22.9)
CPU60: cpu (U3.67), euromap (U12.5)
CPU61: cpu (U3.66), euromap (U12.7)
CPU62: cpu (U3.68), euromap (U12.43)
CPU63: cpu (U3.69), euromap (U12.42)